# EAGLE design airflow_sensor_teensy2 (EAGLE 9.5.2)
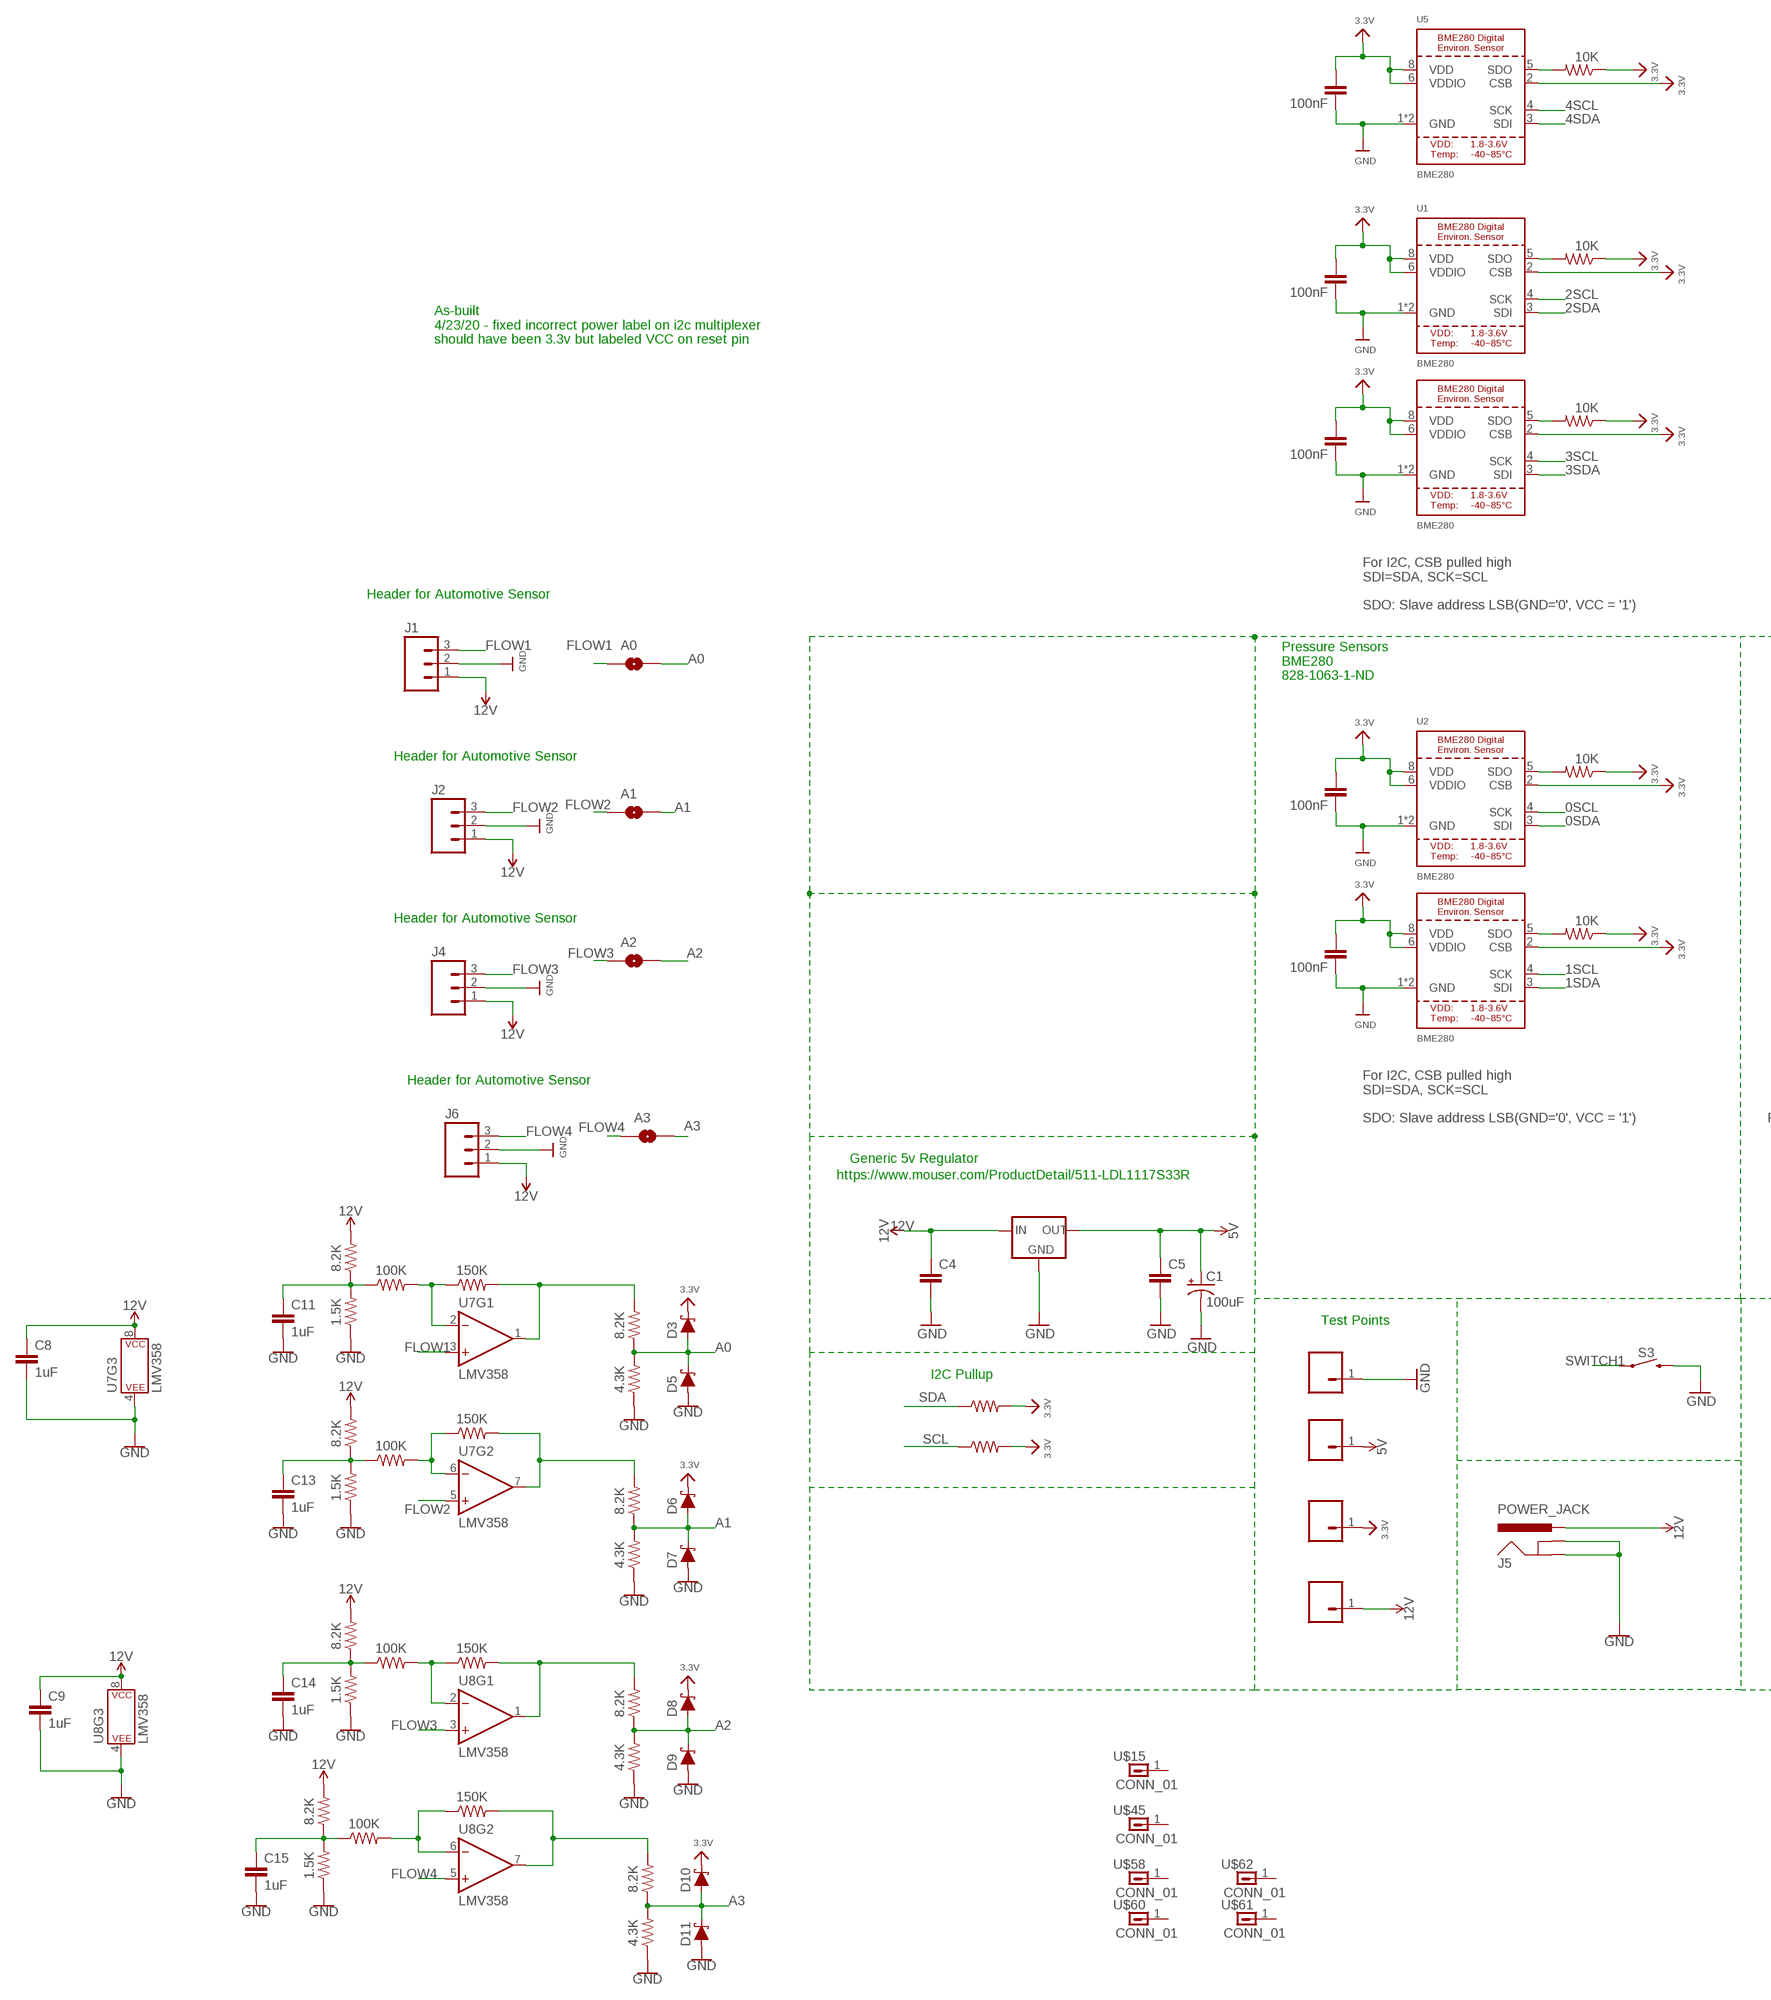
[diagram p0: schematic, sheet 1, part 1 of 2]
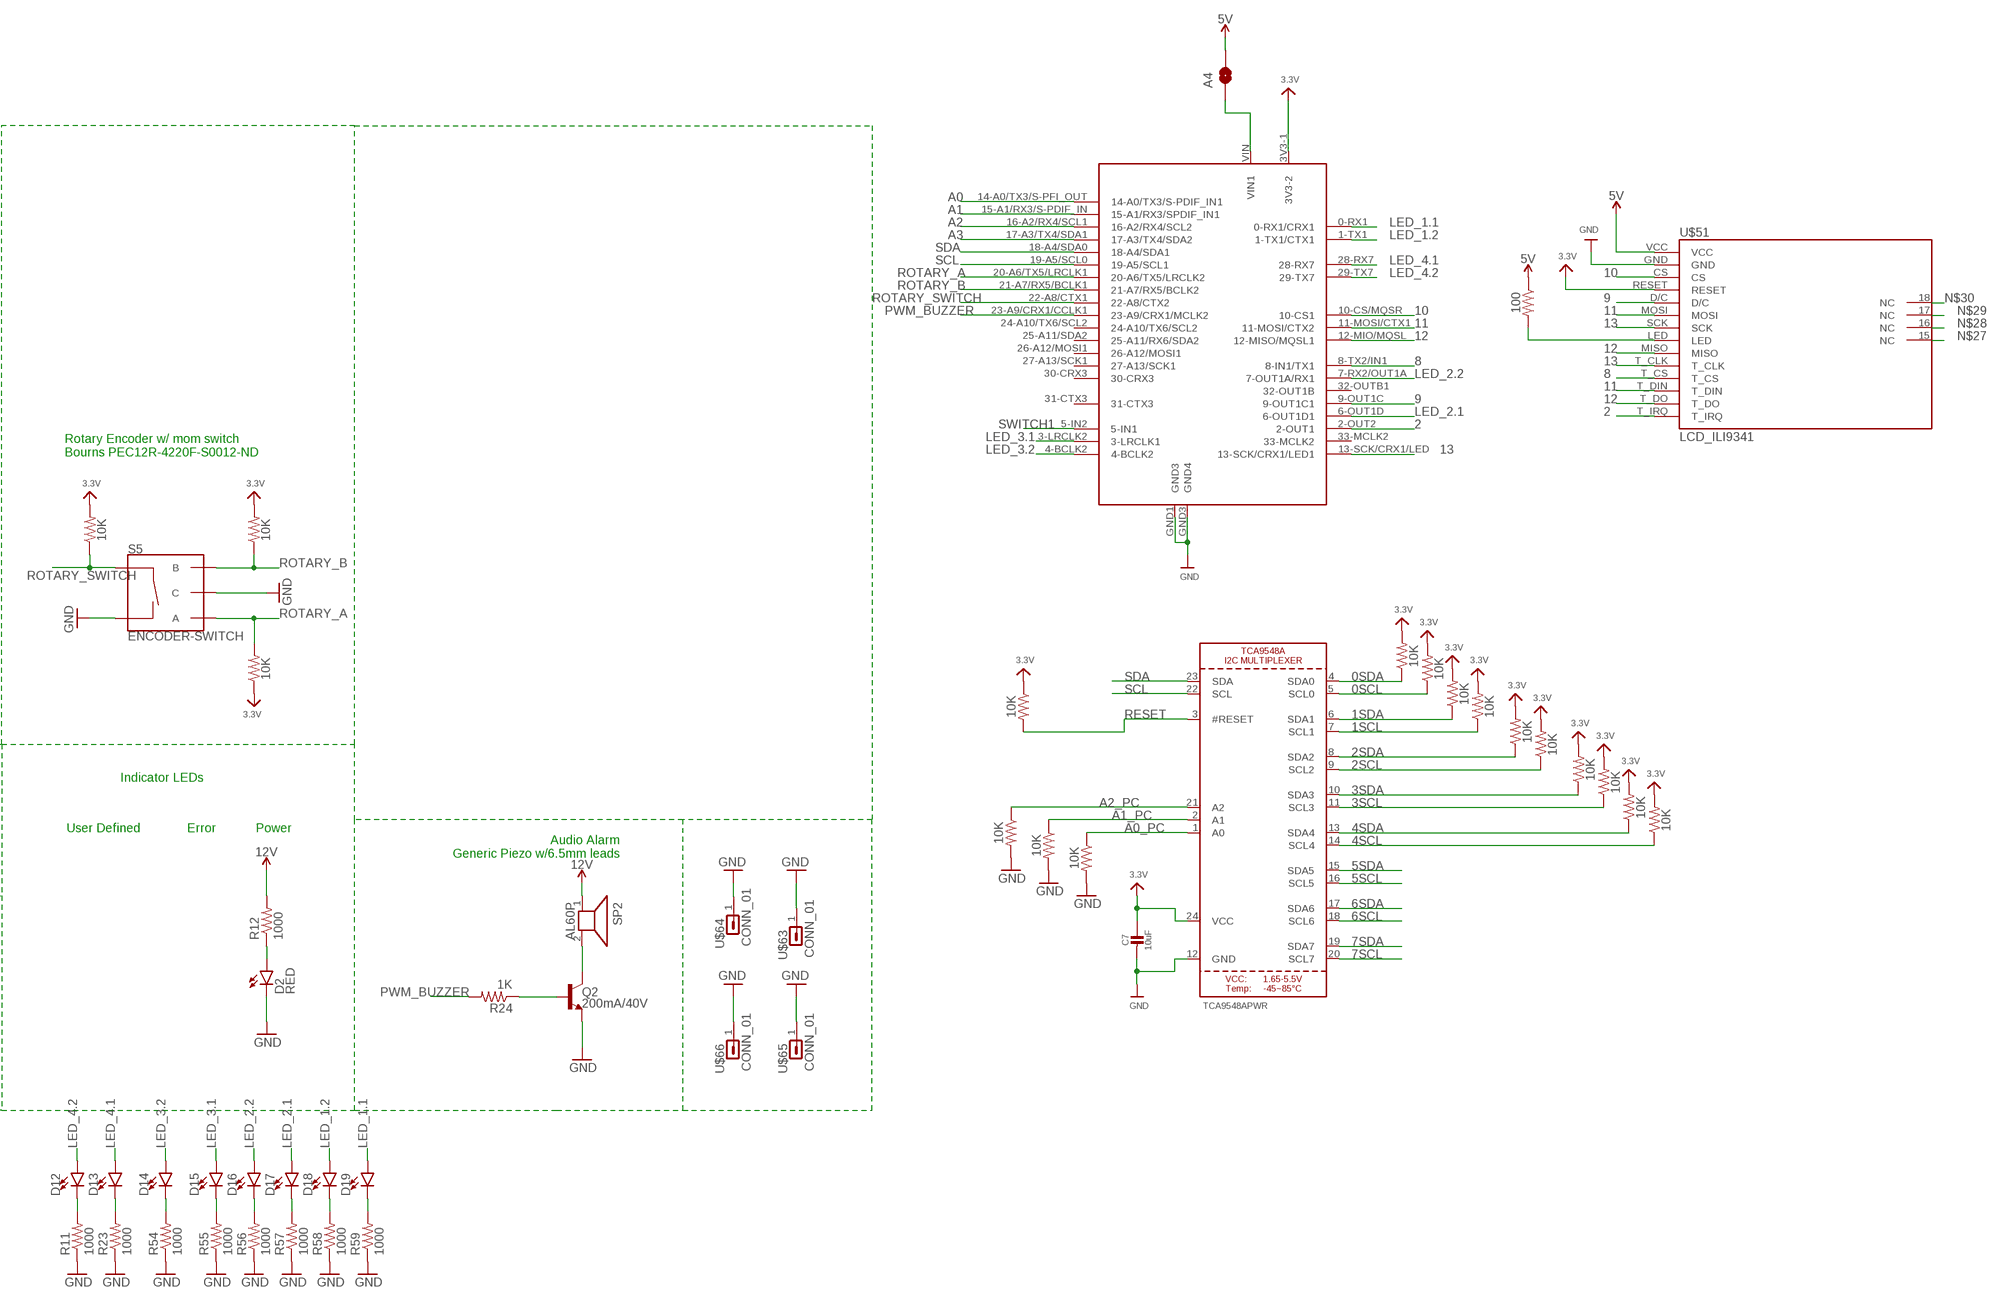
[diagram p1: schematic, sheet 1, part 2 of 2]

## Parts
3V_REGULATOR  LDL1117_5V_REG  [SOT223]
A0  JUMPER-SMT_2_NO_NO-SILK  [SMT-JUMPER_2_NO_NO-SILK]
A1  JUMPER-SMT_2_NO_NO-SILK  [SMT-JUMPER_2_NO_NO-SILK]
A2  JUMPER-SMT_2_NO_NO-SILK  [SMT-JUMPER_2_NO_NO-SILK]
A3  JUMPER-SMT_2_NO_NO-SILK  [SMT-JUMPER_2_NO_NO-SILK]
A4  JUMPER-SMT_2_NO_NO-SILK  [SMT-JUMPER_2_NO_NO-SILK]
C1  100uF  100UF-POLAR-RADIAL-2.5MM-25V-20%  [CPOL-RADIAL-2.5MM-6.5MM]
C2  100nF  CAP-0805  [0805]
C3  100nF  CAP-0805  [0805]
C4  CAP-0805  [0805]
C5  CAP-0805  [0805]
C6  100nF  CAP-0805  [0805]
C7  10uF  CAP_CERAMIC0805-NOOUTLINE  [0805-NO]
C8  1uF  CAP-0805  [0805]
C9  1uF  CAP-0805  [0805]
C10  100nF  CAP-0805  [0805]
C11  1uF  CAP-0805  [0805]
C12  100nF  CAP-0805  [0805]
C13  1uF  CAP-0805  [0805]
C14  1uF  CAP-0805  [0805]
C15  1uF  CAP-0805  [0805]
D2  RED  LED-RED1206  [LED-1206]
D3  3A/40V/500mV  DIODE-SCHOTTKY-B340A  [SMA-DIODE]
D5  3A/40V/500mV  DIODE-SCHOTTKY-B340A  [SMA-DIODE]
D6  3A/40V/500mV  DIODE-SCHOTTKY-B340A  [SMA-DIODE]
D7  3A/40V/500mV  DIODE-SCHOTTKY-B340A  [SMA-DIODE]
D8  3A/40V/500mV  DIODE-SCHOTTKY-B340A  [SMA-DIODE]
D9  3A/40V/500mV  DIODE-SCHOTTKY-B340A  [SMA-DIODE]
D10  3A/40V/500mV  DIODE-SCHOTTKY-B340A  [SMA-DIODE]
D11  3A/40V/500mV  DIODE-SCHOTTKY-B340A  [SMA-DIODE]
D12  LED5MM  [LED_5MM]
D13  LED5MM  [LED_5MM]
D14  LED5MM  [LED_5MM]
D15  LED5MM  [LED_5MM]
D16  LED5MM  [LED_5MM]
D17  LED5MM  [LED_5MM]
D18  LED5MM  [LED_5MM]
D19  LED5MM  [LED_5MM]
J1  M03SCREW  [SCREWTERMINAL-3.5MM-3]
J2  M03SCREW  [SCREWTERMINAL-3.5MM-3]
J4  M03SCREW  [SCREWTERMINAL-3.5MM-3]
J5  POWER_JACK  [POWER_JACK_PTH]
J6  M03SCREW  [SCREWTERMINAL-3.5MM-3]
Q2  200mA/40V  TRANS_NPN-2N3904  [TO-92]
R1  10K  RESISTOR0805-RES  [0805]
R2  10K  RESISTOR0805-RES  [0805]
R3  10K  RESISTOR0805-RES  [0805]
R4  10K  RESISTOR0805-RES  [0805]
R5  10K  RESISTOR0805-RES  [0805]
R6  10K  0.3OHM-0805-1/8W-1%  [0805]
R7  10K  0.3OHM-0805-1/8W-1%  [0805]
R8  10K  0.3OHM-0805-1/8W-1%  [0805]
R9  10K  0.3OHM-0805-1/8W-1%  [0805]
R10  10K  0.3OHM-0805-1/8W-1%  [0805]
R11  1000  RESISTOR0805-RES  [0805]
R12  1000  RESISTOR0805-RES  [0805]
R13  10K  0.3OHM-0805-1/8W-1%  [0805]
R14  10K  0.3OHM-0805-1/8W-1%  [0805]
R15  10K  0.3OHM-0805-1/8W-1%  [0805]
R16  10K  0.3OHM-0805-1/8W-1%  [0805]
R17  10K  0.3OHM-0805-1/8W-1%  [0805]
R18  10K  0.3OHM-0805-1/8W-1%  [0805]
R19  10K  0.3OHM-0805-1/8W-1%  [0805]
R20  10K  0.3OHM-0805-1/8W-1%  [0805]
R21  0.3  0.3OHM-0805-1/8W-1%  [0805]
R22  0.3  0.3OHM-0805-1/8W-1%  [0805]
R23  1000  RESISTOR0805-RES  [0805]
R24  1K  RESISTOR0805-RES  [0805]
R25  10K  0.3OHM-0805-1/8W-1%  [0805]
R26  10K  0.3OHM-0805-1/8W-1%  [0805]
R27  10K  0.3OHM-0805-1/8W-1%  [0805]
R28  10K  0.3OHM-0805-1/8W-1%  [0805]
R29  150K  0.3OHM-0805-1/8W-1%  [0805]
R30  150K  0.3OHM-0805-1/8W-1%  [0805]
R31  150K  0.3OHM-0805-1/8W-1%  [0805]
R32  150K  0.3OHM-0805-1/8W-1%  [0805]
R33  4.3K  0.3OHM-0805-1/8W-1%  [0805]
R34  8.2K  0.3OHM-0805-1/8W-1%  [0805]
R35  4.3K  0.3OHM-0805-1/8W-1%  [0805]
R36  8.2K  0.3OHM-0805-1/8W-1%  [0805]
R37  4.3K  0.3OHM-0805-1/8W-1%  [0805]
R38  8.2K  0.3OHM-0805-1/8W-1%  [0805]
R39  4.3K  0.3OHM-0805-1/8W-1%  [0805]
R40  8.2K  0.3OHM-0805-1/8W-1%  [0805]
R41  8.2K  0.3OHM-0805-1/8W-1%  [0805]
R42  1.5K  0.3OHM-0805-1/8W-1%  [0805]
R43  100K  0.3OHM-0805-1/8W-1%  [0805]
R44  8.2K  0.3OHM-0805-1/8W-1%  [0805]
R45  1.5K  0.3OHM-0805-1/8W-1%  [0805]
R46  100K  0.3OHM-0805-1/8W-1%  [0805]
R47  8.2K  0.3OHM-0805-1/8W-1%  [0805]
R48  1.5K  0.3OHM-0805-1/8W-1%  [0805]
R49  100K  0.3OHM-0805-1/8W-1%  [0805]
R50  8.2K  0.3OHM-0805-1/8W-1%  [0805]
R51  1.5K  0.3OHM-0805-1/8W-1%  [0805]
R52  100K  0.3OHM-0805-1/8W-1%  [0805]
R53  100  0.3OHM-0805-1/8W-1%  [0805]
R54  1000  RESISTOR0805-RES  [0805]
R55  1000  RESISTOR0805-RES  [0805]
R56  1000  RESISTOR0805-RES  [0805]
R57  1000  RESISTOR0805-RES  [0805]
R58  1000  RESISTOR0805-RES  [0805]
R59  1000  RESISTOR0805-RES  [0805]
S3  MOMENTARY-SWITCH-SPST-PTH-6.0MM-KIT  [TACTILE_SWITCH_PTH_6.0MM_KIT]
S5  ENCODER-SWITCH  [ROTARY_ENC_PLAIN]
SP2  AL60P  [AL60P]
U1  BME280  [BME280]
U2  BME280  [BME280]
U3  BME280  [BME280]
U4  BME280  [BME280]
U5  BME280  [BME280]
U6  TCA9548APWR  TCA9548A  [TSSOP24]
U7  LMV358  LMV358SOIC  [SO08]
U8  LMV358  LMV358SOIC  [SO08]
U$15  CONN_01  [1X01-#6_MACHINE]
U$20  CONN_0138MILL  [1X01-40MILL]
U$31  CONN_0138MILL  [1X01-40MILL]
U$40  CONN_0138MILL  [1X01-40MILL]
U$45  CONN_01  [1X01-#6_MACHINE]
U$51  LCD_ILI9341  [ILI9341]
U$58  CONN_01  [1X01-#6_MACHINE]
U$59  CONN_0138MILL  [1X01-40MILL]
U$60  CONN_01  [1X01-#6_MACHINE]
U$61  CONN_01  [1X01-#6_MACHINE]
U$62  CONN_01  [1X01-#6_MACHINE]
U$63  CONN_01  [1X01-#6_MACHINE]
U$64  CONN_01  [1X01-#6_MACHINE]
U$65  CONN_01  [1X01-#6_MACHINE]
U$66  CONN_01  [1X01-#6_MACHINE]
U$67  TEENSY_ALL_PINS  [TEENSY4-ALL_PINS]

## Nets
0SCL: R8.1 U2.4(SCK) U6.5(SCL0)
0SDA: R7.1 U2.3(SDI) U6.4(SDA0)
1SCL: R10.1 U4.4(SCK) U6.7(SCL1)
1SDA: R9.1 U4.3(SDI) U6.6(SDA1)
2: U$51.T_IRQ U$67.2-OUT2(2-OUT1)
2SCL: R14.1 U1.4(SCK) U6.9(SCL2)
2SDA: R13.1 U1.3(SDI) U6.8(SDA2)
3.3V: C2.1 C3.1 C6.1 C7.1 C10.1 C12.1 D3.C D6.C D8.C D10.C R1.1 R2.1 R3.1 R4.1 R5.1 R6.1 R7.2 R8.2 R9.2 R10.2 R13.2 R14.2 R15.2 R16.2 R17.2 R18.2 R21.2 R22.2 R26.2 R27.1 R28.2 U1.2(CSB) U1.6(VDDIO) U1.8(VDD) U2.2(CSB) U2.6(VDDIO) U2.8(VDD) U3.2(CSB) U3.6(VDDIO) U3.8(VDD) U4.2(CSB) U4.6(VDDIO) U4.8(VDD) U5.2(CSB) U5.6(VDDIO) U5.8(VDD) U6.24(VCC) U$20.1 U$51.RESET U$67.3V3-1(3V3-2)
3SCL: R16.1 U3.4(SCK) U6.11(SCL3)
3SDA: R15.1 U3.3(SDI) U6.10(SDA3)
4SCL: R18.1 U5.4(SCK) U6.14(SCL4)
4SDA: R17.1 U5.3(SDI) U6.13(SDA4)
5SCL: U6.16(SCL5)
5SDA: U6.15(SDA5)
5V: 3V_REGULATOR.2(OUT) 3V_REGULATOR.4(OUT) A4.2 C1.1(+) C5.1 R53.1 U$51.VCC U$59.1
6SCL: U6.18(SCL6)
6SDA: U6.17(SDA6)
7SCL: U6.20(SCL7)
7SDA: U6.19(SDA7)
8: U$51.T_CS U$67.8-TX2/IN1(8-IN1/TX1)
9: U$51.D/C U$67.9-OUT1C(9-OUT1C1)
10: U$51.CS U$67.10-CS/MQSR(10-CS1)
11: U$51.MOSI U$51.T_DIN U$67.11-MOSI/CTX1(11-MOSI/CTX2)
12: U$51.MISO U$51.T_DO U$67.12-MIO/MQSL(12-MISO/MQSL1)
12V: 3V_REGULATOR.3(IN) C4.1 C8.1 C9.1 J1.1 J2.1 J4.1 J5.PWR J6.1 R12.2 R41.2 R44.2 R47.2 R50.2 SP2.1 U7.8(P$V+) U8.8(P$V+) U$40.1
13: U$51.SCK U$51.T_CLK U$67.13-SCK/CRX1/LED(13-SCK/CRX1/LED1)
A0: A0.2 D3.A D5.C R33.2 R40.1 U$67.14-A0/TX3/S-PFI_OUT(14-A0/TX3/S-PDIF_IN1)
A0_PC: R19.1 U6.1(A0)
A1: A1.2 D6.A D7.C R34.1 R35.2 U$67.15-A1/RX3/S-PDIF_IN(15-A1/RX3/SPDIF_IN1)
A1_PC: R20.1 U6.2(A1)
A2: A2.2 D8.A D9.C R36.1 R37.2 U$67.16-A2/RX4/SCL1(16-A2/RX4/SCL2)
A2_PC: R25.1 U6.21(A2)
A3: A3.2 D10.A D11.C R38.1 R39.2 U$67.17-A3/TX4/SDA1(17-A3/TX4/SDA2)
FLOW1: A0.1 J1.3 U7.3(+IN)
FLOW2: A1.1 J2.3 U7.5(+IN)
FLOW3: A2.1 J4.3 U8.3(+IN)
FLOW4: A3.1 J6.3 U8.5(+IN)
GND: 3V_REGULATOR.1(GND) C1.2(-) C2.2 C3.2 C4.2 C5.2 C6.2 C7.2 C8.2 C9.2 C10.2 C11.2 C12.2 C13.2 C14.2 C15.2 D2.C D5.A D7.A D9.A D11.A J1.2 J2.2 J4.2 J5.GND J5.GNDBREAK J6.2 Q2.1(E) R11.1 R19.2 R20.2 R23.1 R25.2 R33.1 R35.1 R37.1 R39.1 R42.1 R45.1 R48.1 R51.1 R54.1 R55.1 R56.1 R57.1 R58.1 R59.1 S3.3 S5.C S5.SW- U1.1(GND) U1.7(GND) U2.1(GND) U2.7(GND) U3.1(GND) U3.7(GND) U4.1(GND) U4.7(GND) U5.1(GND) U5.7(GND) U6.12(GND) U7.4(P$V-) U8.4(P$V-) U$31.1 U$51.GND U$63.1 U$64.1 U$65.1 U$66.1 U$67.GND1(GND3) U$67.GND3(GND4)
LED_1.1: D19.A U$67.0-RX1(0-RX1/CRX1)
LED_1.2: D18.A U$67.1-TX1(1-TX1/CTX1)
LED_2.1: D17.A U$67.6-OUT1D(6-OUT1D1)
LED_2.2: D16.A U$67.7-RX2/OUT1A(7-OUT1A/RX1)
LED_3.1: D15.A U$67.3-LRCLK2(3-LRCLK1)
LED_3.2: D14.A U$67.4-BCLK2
LED_4.1: D13.A U$67.28-RX7
LED_4.2: D12.A U$67.29-TX7
N$1: R3.2 U1.5(SDO)
N$2: D2.A R12.1
N$3: D12.K(C) R11.2
N$5: R4.2 U3.5(SDO)
N$6: R1.2 U4.5(SDO)
N$7: D13.K(C) R23.2
N$8: R2.2 U2.5(SDO)
N$9: Q2.3(C) SP2.2
N$10: Q2.2(B) R24.1
N$11: D14.K(C) R54.2
N$12: R5.2 U5.5(SDO)
N$13: D15.K(C) R55.2
N$14: D16.K(C) R56.2
N$15: D17.K(C) R57.2
N$16: D18.K(C) R58.2
N$17: D19.K(C) R59.2
N$18: R32.2 R38.2 U8.7(OUT)
N$19: R32.1 R52.2 U8.6(-IN)
N$20: R31.2 R36.2 U8.1(OUT)
N$21: R31.1 R49.2 U8.2(-IN)
N$22: R30.2 R34.2 U7.7(OUT)
N$23: R30.1 R46.2 U7.6(-IN)
N$24: R29.2 R40.2 U7.1(OUT)
N$25: R29.1 R43.2 U7.2(-IN)
N$26: A4.1 U$67.VIN(VIN1)
N$27: U$51.15(NC)
N$28: U$51.16(NC)
N$29: U$51.17(NC)
N$30: U$51.18(NC)
N$35: R53.2 U$51.LED
PWM_BUZZER: R24.2 U$67.23-A9/CRX1/CCLK1(23-A9/CRX1/MCLK2)
RESET: R6.2 U6.3(#RESET)
ROTARY_A: R27.2 S5.A U$67.20-A6/TX5/LRCLK1(20-A6/TX5/LRCLK2)
ROTARY_B: R26.1 S5.B U$67.21-A7/RX5/BCLK1(21-A7/RX5/BCLK2)
ROTARY_SWITCH: R28.1 S5.SW+ U$67.22-A8/CTX1(22-A8/CTX2)
SCL: R22.1 U6.22(SCL) U$67.19-A5/SCL0(19-A5/SCL1)
SDA: R21.1 U6.23(SDA) U$67.18-A4/SDA0(18-A4/SDA1)
SWITCH1: S3.1 U$67.5-IN2(5-IN1)
X4: C14.1 R47.1 R48.2 R49.1
X5: C15.1 R50.1 R51.2 R52.1
XX: C13.1 R44.1 R45.2 R46.1
XXX: C11.1 R41.1 R42.2 R43.1
Unconnected: U$15.1 U$45.1 U$58.1 U$60.1 U$61.1 U$62.1 U$67.24-A10/TX6/SCL2 U$67.25-A11/SDA2(25-A11/RX6/SDA2) U$67.26-A12/MOSI1 U$67.27-A13/SCK1 U$67.30-CRX3 U$67.31-CTX3 U$67.32-OUTB1(32-OUT1B) U$67.33-MCLK2

## Notes on the sheet
- As-built
  4/23/20 - fixed incorrect power label on i2c multiplexer
  should have been 3.3v but labeled VCC on reset pin
- Header for Automotive Sensor
- For I2C, CSB pulled high
  SDI=SDA, SCK=SCL
  
  SDO: Slave address LSB(GND='0', VCC = '1')
- Pressure Sensors
  BME280
  828-1063-1-ND
- Header for Automotive Sensor
- Header for Automotive Sensor
- Rotary Encoder w/ mom switch
  Bourns PEC12R-4220F-S0012-ND
- Header for Automotive Sensor
- For I2C, CSB pulled high
  SDI=SDA, SCK=SCL
  
  SDO: Slave address LSB(GND='0', VCC = '1')
- Generic 5v Regulator
- https://www.mouser.com/ProductDetail/511-LDL1117S33R
- Test Points
- Indicator LEDs
- I2C Pullup
- User Defined | Error | Power
- Audio Alarm
  Generic Piezo w/6.5mm leads

## Library data of the parts
3V_REGULATOR = th_libraries_2:LDL1117_5V_REG: STMicroelectronics LDL1117S50R https://www.mouser.com/datasheet/2/389/ldl1117-1156241.pdf Mouser#: 511-LDL1117S50R bought 100 for $18 on ~2/3/18 5V, 1.2amp
A0 A1-A4 = SparkFun-Jumpers:JUMPER-SMT_2_NO: Normally open jumper This jumper has two pads in close proximity to each other. Apply solder to close the connection. Round pads are easier to solder for beginners, but are a lot larger. SparkFun Product that uses the round pads: SparkFun EL Sequencer <https://www.sparkfun.com/products/12781>
C1 = SparkFun-Capacitors:100UF-POLAR: 100µF polarized capacitors A capacitor is a passive two-terminal electrical component used to store electrical energy temporarily in an electric field.; PROD_ID: CAP-08439
C2-C6 C8-C15 = SparkFun-Capacitors:CAP
C7 = microbuilder:CAP_CERAMIC: Ceramic Capacitors For new designs, use the packages preceded by an '_' character since they are more reliable: The following footprints should be used on most boards: _0402 - Standard footprint for regular board layouts _0603 - Standard footprint for regular board layouts _0805 - Standard footprint for regular board layouts _1206 - Standard footprint for regular board layouts For extremely tight-pitch boards where space is at a premium, the following 'micro-pitch' footprints can be used (smaller pads, no silkscreen outline, etc.): _0402MP - Micro-pitch footprint for very dense/compact boards _0603MP - Micro-pitch footprint for very dense/compact boards _0805MP - Micro-pitch footprint for very dense/compact boards _1206MP - Micro-pitch footprint for very dense/compact boards
D2 = SparkFun-LED:LED-RED: Red SMD LED Used in manufacturing of most products at SparkFun Packages: 0603 - SMD 0603 package [Product Link] <http://docs.avagotech.com/docs/AV02-0551EN> 0603 SMART - SMD 0603 SMART package ( more efficient and expensive)[Product Link] <http://www.osram-os.com/Graphics/XPic2/00077099_0.pdf> 1206 - SMD1206 package [Product Link] <https://www.sparkfun.com/datasheets/DevTools/LilyPad/Q150OVS4.pdff> SparkFun Products: Pro Mini 328 -5V <https://www.sparkfun.com/products/821> RedBoard <https://www.sparkfun.com/products/12757> IOIO-OTG <https://www.sparkfun.com/products/13613>; PROD_ID: DIO-09912
D3 D5-D11 = SparkFun-DiscreteSemi:DIODE-SCHOTTKY: Schottky diode A Schottky diode is a semiconductor diode which has a low forward voltage drop and a very fast switching action.; PROD_ID: DIO-09886
D12-D19 = SparkFun-LED:LED: LED (Generic) Standard schematic elements and footprints for 5mm, 3mm, 1206, and 0603 sized LEDs. Generic LEDs with no color specified.
J1 J2 J4 J6 = SparkFun-Connectors:M03: Header 3 Standard 3-pin 0.1" header. Use with straight break away headers (SKU : PRT-00116), right angle break away headers (PRT-00553), swiss pins (PRT-00743), machine pins (PRT-00117), and female headers (PRT-00115). Molex polarized connector foot print use with SKU : PRT-08232 with associated crimp pins and housings.; PROD_ID: CONN-08288
J5 = SparkFun-Connectors:POWER_JACK: Power Jack Connector This is the standard 5.5mm barrel jack for power. The PTH is the most common, proven, reliable, footprint. The Slot footprint only works if the mill layer is transmitted to the PCB fab house so be warned. Here are the connectors we sell at SparkFun: DC Barrel Power Jack/Connector <https://www.sparkfun.com/products/119> (PRT-00119) DC Barrel Power Jack/Connector (SMD) <https://www.sparkfun.com/products/12748> (PRT-12748) DC Barrel Jack Adapter - Breadboard Compatible <https://www.sparkfun.com/products/10811> (PRT-10811) It is used on this SparkFun product (and many, many others): SparkFun RedBoard - Programmed with Arduino <https://www.sparkfun.com/products/12757> (DEV-12757) Also, if you need a mating power supply or connector, please check these out: Wall Adapter Power Supply - 9VDC 650mA <https://www.sparkfun.com/products/298> (TOL-00298) DC Barrel Jack Adapter - Male <https://www.sparkfun.com/products/10287> (PRT-10287); PROD_ID: CONN-08197
Q2 = SparkFun-DiscreteSemi:TRANS_NPN: NPN transistor Current controlled devices typically used to amplify current or used as a switch. BC547 - COM-08928 <http://www.sparkfun.com/products/8928> (TO-92 45V 100mA) (1.Collector 2.Base 3.Emitter) 2N3904 - COM-00521 <http://www.sparkfun.com/products/521> (TO-92 40V 200mA) (1.Emitter 2.Base 3.Collector) P2N2222A - COM-12852 <http://www.sparkfun.com/products/12852> (TO-92 40V 600mA) (1.Collector 2.Base 3.Emitter); PROD_ID: TRANS-08447
R1-R5 R11 R12 R23 R24 R54-R59 = SparkFun-Passives:RESISTOR: Resistor Basic schematic elements and footprints for 0603, 1206, and PTH resistors.
R6-R10 R13-R20 R25-R53 = SparkFun-Resistors:0.3OHM: 0.3Ω resistor A resistor is a passive two-terminal electrical component that implements electrical resistance as a circuit element. Resistors act to reduce current flow, and, at the same time, act to lower voltage levels within circuits. - Wikipedia; PROD_ID: RES-11622; VALUE: 0.3
R21 R22 = SparkFun-Resistors:0.3OHM: 0.3Ω resistor A resistor is a passive two-terminal electrical component that implements electrical resistance as a circuit element. Resistors act to reduce current flow, and, at the same time, act to lower voltage levels within circuits. - Wikipedia; PROD_ID: RES-11622
S3 = SparkFun-Switches:MOMENTARY-SWITCH-SPST: Momentary Switch (Pushbutton) - SPST Normally-open (NO) SPST momentary switches (buttons, pushbuttons). Variants PTH-12MM - 12mm square, through-hole Momentary Pushbutton Switch - 12mm Square <https://www.sparkfun.com/products/9190> (COM-09190) PTH-6.0MM, PTH-6.0MM-KIT - 6.0mm square, through-hole Mini Pushbutton Switch <https://www.sparkfun.com/products/97> (COM-00097) KIT package intended for soldering kit's - only one side of pads' copper is exposed. PTH-RIGHT-ANGLE-KIT - Right-angle, through-hole Right Angle Tactile Button <https://www.sparkfun.com/products/10791> - Used on SparkFun BigTime Watch Kit <https://www.sparkfun.com/products/11734> SMD-12MM - 12mm square, surface-mount Tactile Button - SMD (12mm) <https://www.sparkfun.com/products/12993> (COM-12993) Used on SparkFun PicoBoard <https://www.sparkfun.com/products/11888> SMD-4.5MM - 4.5mm Square Trackball Switch Used on SparkFun Blackberry Trackballer Breakout <https://www.sparkfun.com/products/13169> SMD-4.6MMX2.8MM - 4.60mm x 2.80mm, surface mount Used on SparkFun SAMD21 Mini Breakout <https://www.sparkfun.com/products/13664> SMD-5.2MM, SMD-5.2-REDUNDANT - 5.2mm square, surface-mount Mini Pushbutton Switch - SMD <https://www.sparkfun.com/products/8720> (COM-08720) Used on Arduino Pro Mini <https://www.sparkfun.com/products/11114> REDUNDANT package connects both switch circuits together SMD-6.0X3.5MM - 6.0 x 3.5mm, surface mount Momentary Reset Switch SMD <https://www.sparkfun.com/products/8229> (COM-08229) SMD-6.2MM-TALL - 6.2mm square, surface mount Tactile Button - SMD (6mm) <https://www.sparkfun.com/products/12992> Used on SparkFun Digital Sandbox <https://www.sparkfun.com/products/12651> SMD-RIGHT-ANGLE - Right-angle, surface mount Used on SparkFun Block for Intel® Edison - Arduino <https://www.sparkfun.com/products/13036>; PROD_ID: SWCH-08441; SF_SKU: COM-00097
S5 = SparkFun-Switches:ENCODER-SWITCH: Rotary Encoder w/ Select Switch Encoders rotate similarly to potentiometers, but they’re different from potentiometers in that an encoder has full rotation without limits. They output gray code so that you can tell how much and in which direction the encoder has been turned. This encoder includes a push-down select switch built into the shaft. SparkFun Products Rotary Encoder <https://www.sparkfun.com/products/9117> (COM-09117); SF_SKU: COM-09117
SP2 = buzzer:AL60P: SPEAKER Source: Buerklin; OC_FARNELL: unknown; OC_NEWARK: unknown
U1-U5 = microbuilder:BME280: BME280 - Environmental Sensor (I2C + SPI)
U6 = microbuilder:TCA9548A: TCA9548A I2C Multiplexer
U7 U8 = SparkFun-IC-Amplifiers:LMV358: IC LMV358 DUAL OP AMP Jellybean rail-to-rail output op-amp SparkFun Products SparkFun PicoBoard <https://www.sparkfun.com/products/11888> (WIG-11888) SparkFun Vernier Interface Shield <https://www.sparkfun.com/products/12858> (DEV-12858) SparkFun Blynk Board - ESP8266 <https://www.sparkfun.com/products/13794> (WRL-13794) SparkFun Digital Sandbox <https://www.sparkfun.com/products/12651> (DEV-12651 RoHS); PROD_ID: IC-09657
U$15 U$45 U$58 U$60-U$66 = th_libraries:CONN_01: #6 Machine Screw tite - 144mil hole, 256mil diameter
U$20 U$31 U$40 U$59 = th_libraries3:CONN_01: #6 Machine Screw tite - 144mil hole, 256mil diameter
U$51 = ili9341_Display:LCD_ILI9341: PJRC Touch Display https://www.pjrc.com/store/display_ili9341_touch.html
U$67 = teensy:TEENSY_ALL_PINS

## Net classes
1 highpower: width 0.305 mm, drill 0.483 mm
2 lowpower: width 0.305 mm, drill 0.483 mm

## Board
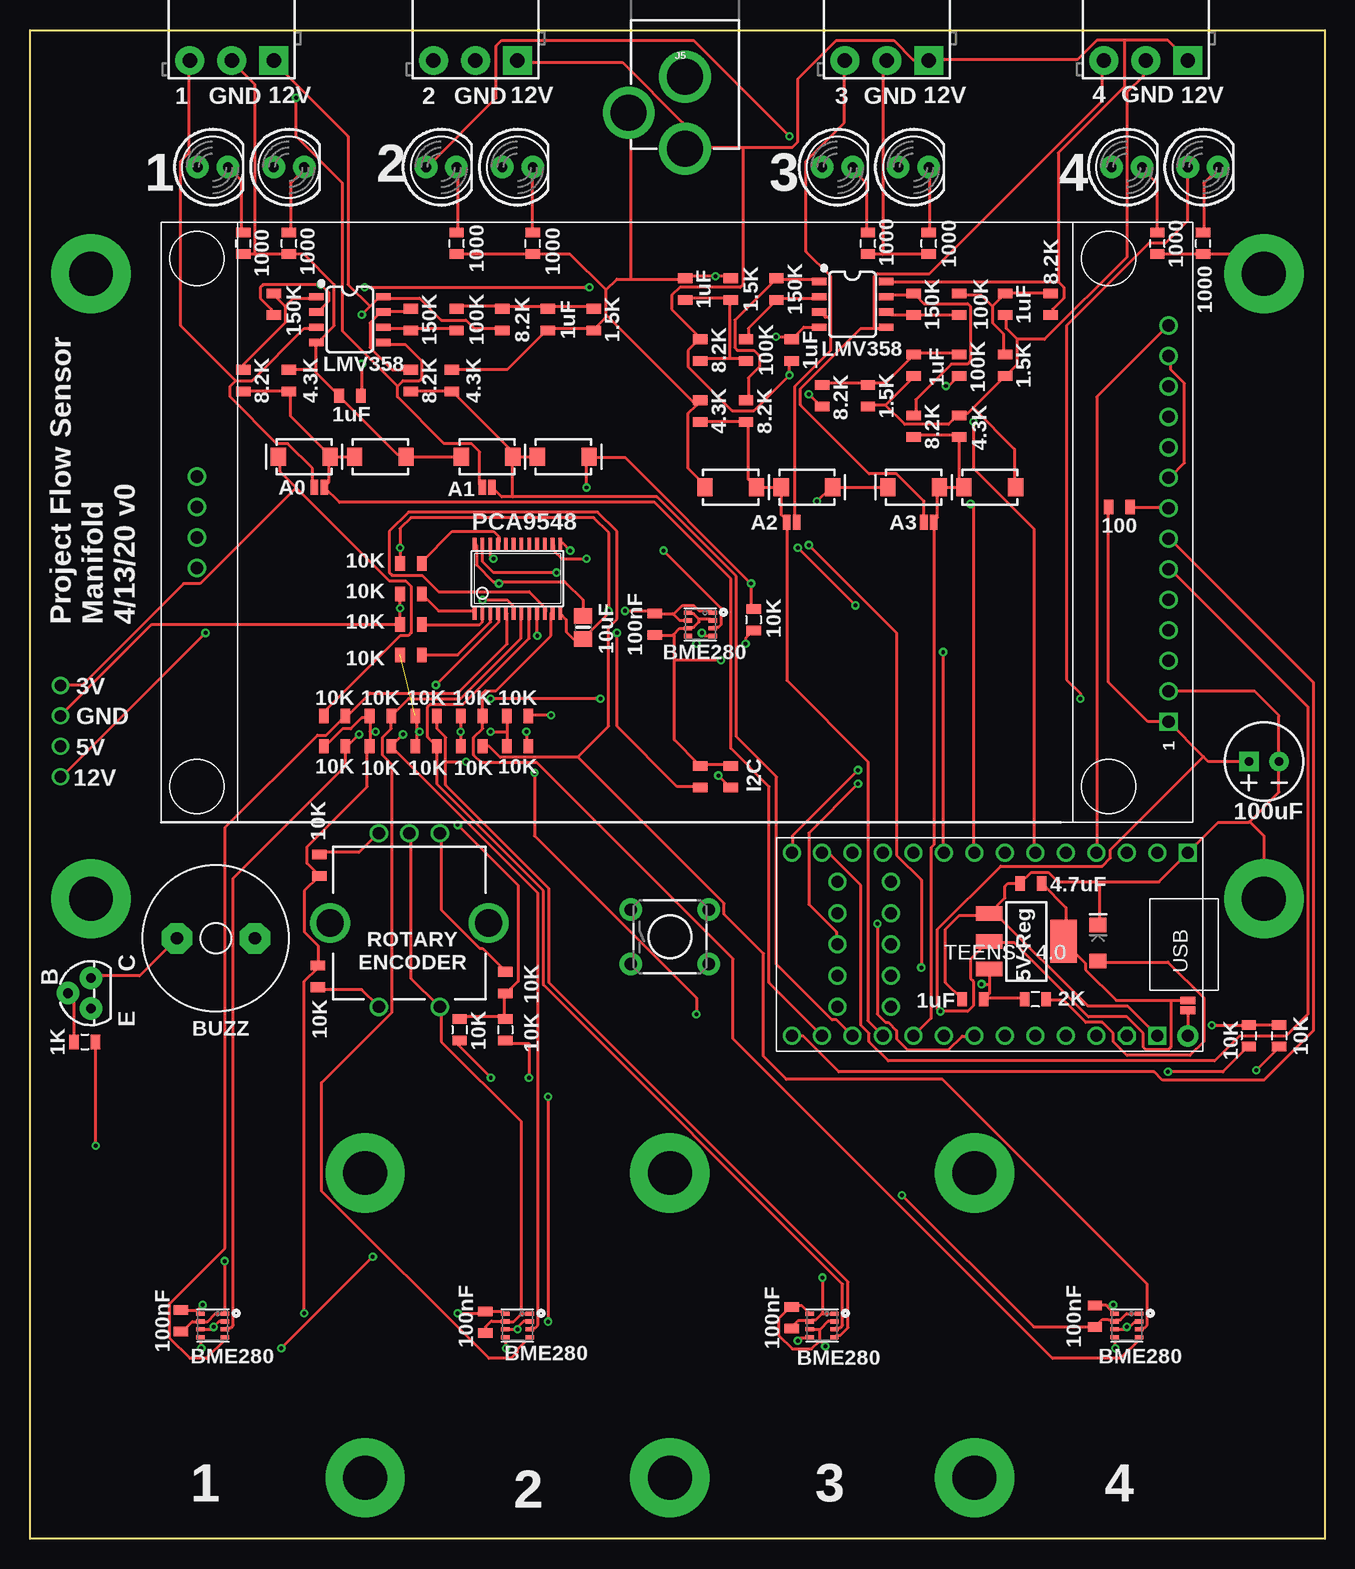
[diagram p2: board, top side]
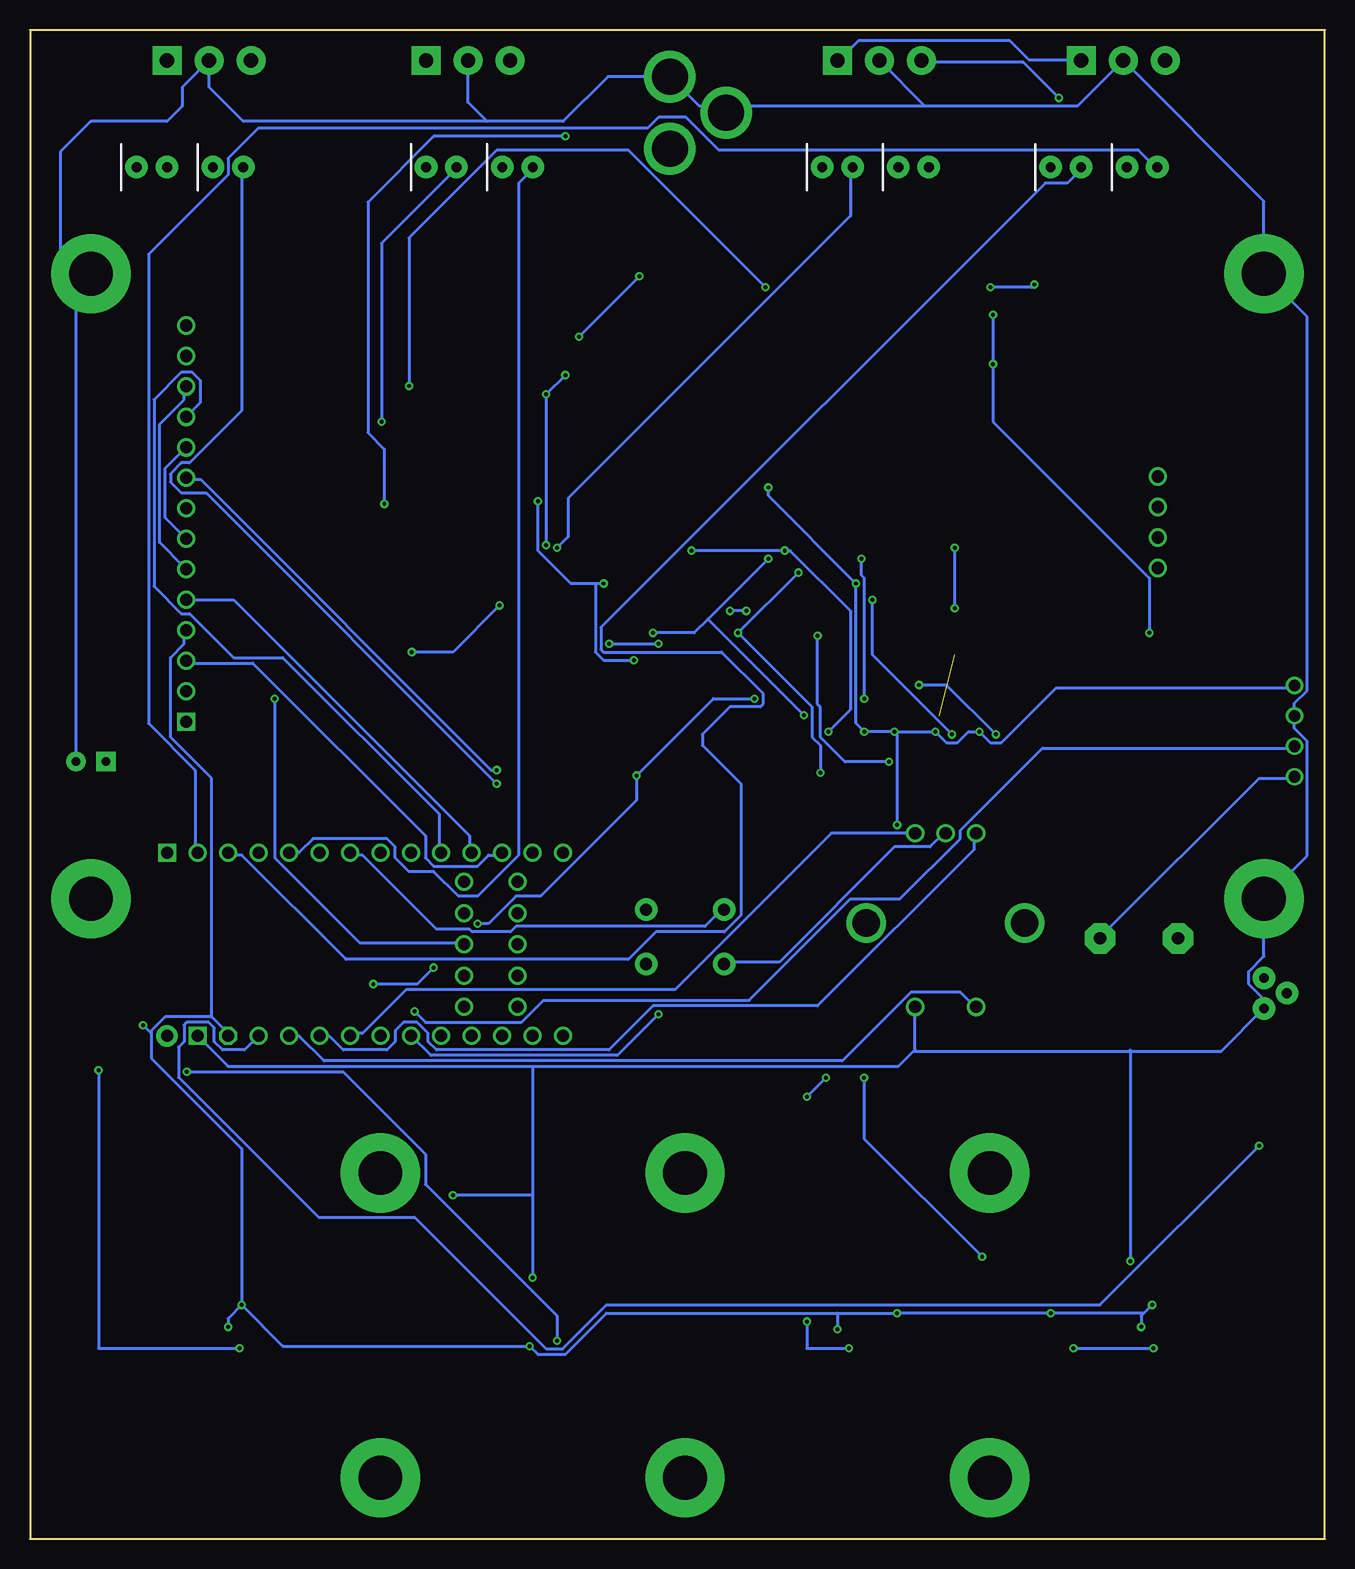
[diagram p3: board, bottom side, seen from below]

Size 107.95 x 125.73 mm. Coordinates in mm from the lower left corner, seen from the top.
Outline: 0,0 0,125.73 107.95,125.73 107.95,0 0,0
Copper layers (1*16): Top 0.0356mm / dielectric 1.5011mm / Bottom 0.0356mm
Design rules "LaenPCBOrder *": minimum track width 10mil, minimum drill 13mil, track to track 8mil, track to pad 8mil, pad to pad 8mil, via to via 8mil, smd to smd 6mil, copper to edge 15mil, drill to drill 6mil, minimum pad ring 7mil, minimum via ring 7mil, stop-mask expansion 3mil, vias tented up to drill 25mil, thermal gap 10mil

### Footprints (pad centres in the part's own frame; a part is rotated, then mirrored left to right if it is on the bottom)
SOT223 = smd 1.219 x 2.235: 1 -2.311,-3.099; 2 0,-3.099; 3 2.311,-3.099 | smd 3.6 x 2.2: 4 0,3.099
SMT-JUMPER_2_NO_NO-SILK = smd 0.635 x 1.27: 1 -0.406,0; 2 0.406,0
CPOL-RADIAL-2.5MM-6.5MM = drill 0.7 pad 1.651 square: 1 1.25,0 | drill 0.7 pad 1.651: 2 -1.25,0
0805 = smd 0.8 x 1.2: 1 -0.9,0; 2 0.9,0
0805-NO = smd 1.3 x 1.5: 1 -0.95,0; 2 0.95,0
LED-1206 = smd 1.2 x 1.4: A -1.5,0; C 1.5,0
SMA-DIODE = smd 1.27 x 1.47: A -2.15,0; C 2.15,0
LED_5MM = drill 0.813 pad 1.88: A -1.27,0; K 1.27,0
SCREWTERMINAL-3.5MM-3 = drill 1.2 pad 2.413 square: 1 0,0 | drill 1.2 pad 2.413: 2 3.5,0; 3 7,0
POWER_JACK_PTH = drill 2.997 pad 4.318: GND 0,7.7; GNDBREAK 4.7,10.7; PWR 0,13.7
TO-92 = drill 0.813 pad 1.88: 1 -1.27,0; 2 0,1.905; 3 1.27,0
TACTILE_SWITCH_PTH_6.0MM_KIT = drill 1.016 pad 1.88: 1 -3.251,2.261; 2 3.251,2.261; 3 -3.251,-2.261; 4 3.251,-2.261
ROTARY_ENC_PLAIN = drill 1.016: A 7.493,-2.54; B 7.493,2.54; C 7.493,0; SW+ -6.985,2.54; SW- -6.985,-2.54 | drill 2.286: P$3 0,6.604; P$4 0,-6.604
AL60P = drill 1.016 pad 2.54 octagon: 1 -3.251,0; 2 3.251,0
BME280 = smd 0.7 x 0.35: 1 1.025,0.975; 2 1.025,0.325; 3 1.025,-0.325; 4 1.025,-0.975; 5 -1.025,-0.975; 6 -1.025,-0.325; 7 -1.025,0.325; 8 -1.025,0.975
TSSOP24 = smd 0.305 x 0.991: 1 -3.575,-2.918; 2 -2.925,-2.918; 3 -2.275,-2.918; 4 -1.625,-2.918; 5 -0.975,-2.918; 6 -0.325,-2.918; 7 0.325,-2.918; 8 0.975,-2.918; 9 1.625,-2.918; 10 2.275,-2.918; 11 2.925,-2.918; 12 3.575,-2.918; 13 3.575,2.918; 14 2.925,2.918; 15 2.275,2.918; 16 1.625,2.918; 17 0.975,2.918; 18 0.325,2.918; 19 -0.325,2.918; 20 -0.975,2.918; 21 -1.625,2.918; 22 -2.275,2.918; 23 -2.925,2.918; 24 -3.575,2.918
SO08 = smd 0.6 x 1.2: 1 -1.905,-2.8; 2 -0.635,-2.8; 3 0.635,-2.8; 4 1.905,-2.8; 5 1.905,2.8; 6 0.635,2.8; 7 -0.635,2.8; 8 -1.905,2.8
1X01-#6_MACHINE = drill 3.658 pad 6.604: 1 0,0
1X01-40MILL = drill 0.965 pad 1.397: 1 0,0
ILI9341 = drill 1.016: 15 3,21.21; 16 3,23.75; 17 3,26.29; 18 3,28.83; CS 84,13.48; D/C 84,18.56; GND 84,10.94; LED 84,26.18; MISO 84,28.72; MOSI 84,21.1; RESET 84,16.02; SCK 84,23.64; T_CLK 84,31.26; T_CS 84,33.8; T_DIN 84,36.34; T_DO 84,38.88; T_IRQ 84,41.42 | drill 1.016 square: VCC 84,8.4
TEENSY4-ALL_PINS = drill 1: 0-RX1 -17.78,-7.62; 1-TX1 -15.24,-7.62; 2-OUT2 -12.7,-7.62; 3-LRCLK2 -10.16,-7.62; 4-BCLK2 -7.62,-7.62; 5-IN2 -5.08,-7.62; 6-OUT1D -2.54,-7.62; 7-RX2/OUT1A 0,-7.62; 8-TX2/IN1 2.54,-7.62; 9-OUT1C 5.08,-7.62; 10-CS/MQSR 7.62,-7.62; 11-MOSI/CTX1 10.16,-7.62; 12-MIO/MQSL 12.7,-7.62; 13-SCK/CRX1/LED 12.7,7.62; 14-A0/TX3/S-PFI_OUT 10.16,7.62; 15-A1/RX3/S-PDIF_IN 7.62,7.62; 16-A2/RX4/SCL1 5.08,7.62; 17-A3/TX4/SDA1 2.54,7.62; 18-A4/SDA0 0,7.62; 19-A5/SCL0 -2.54,7.62; 20-A6/TX5/LRCLK1 -5.08,7.62; 21-A7/RX5/BCLK1 -7.62,7.62; 22-A8/CTX1 -10.16,7.62; 23-A9/CRX1/CCLK1 -12.7,7.62; 24-A10/TX6/SCL2 8.89,5.207; 25-A11/SDA2 4.445,5.207; 26-A12/MOSI1 8.89,2.603; 27-A13/SCK1 4.445,2.603; 28-RX7 8.89,0; 29-TX7 4.445,0; 30-CRX3 8.89,-2.603; 31-CTX3 4.445,-2.603; 32-OUTB1 8.89,-5.207; 33-MCLK2 4.445,-5.207 | drill 1 octagon: 3V3-1 -15.24,7.62 | drill 1 square: GND1 -20.32,-7.62; GND3 -17.78,7.62 | drill 1 pad 1.778: VIN -20.32,7.62

### Placement (x,y rotation side)
3V_REGULATOR  83.06,49.78 270 top
A0  24.13,87.63 0 top
A1  38.1,87.63 0 top
A2  63.5,84.71 180 top
A3  74.93,84.71 0 top
A4  96.52,44.45 90 top
C1  102.87,64.77 180 top
C2  63.5,18.41 270 top
C3  88.77,18.54 270 top
C4  78.61,44.96 180 top
C5  83.44,54.61 180 top
C6  52.07,76.2 90 top
C7  46.1,75.95 270 top
C8  26.67,95.25 180 top
C9  63.5,99.06 90 top
C10  12.57,18.16 270 top
C11  73.66,97.79 270 top
C12  37.97,18.03 270 top
C13  43.18,101.6 270 top
C14  54.61,104.14 90 top
C15  81.28,102.87 270 top
D2  89.03,49.66 90 top
D3  22.86,90.17 180 top
D5  29.21,90.17 180 top
D6  44.45,90.17 0 top
D7  38.1,90.17 0 top
D8  64.77,87.63 0 top
D9  58.42,87.63 0 top
D10  73.66,87.63 180 top
D11  80.01,87.63 180 top
D12  97.79,114.3 0 top
D13  91.44,114.3 0 top
D14  73.66,114.3 0 top
D15  67.31,114.3 0 top
D16  40.64,114.3 0 top
D17  34.29,114.3 0 top
D18  21.59,114.3 0 top
D19  15.24,114.3 0 top
J1  20.32,123.19 180 top
J2  40.64,123.19 180 top
J4  74.93,123.19 180 top
J5  54.61,129.54 180 top
J6  96.52,123.19 180 top
Q2  5.08,45.47 90 top
R1  39.62,42.42 270 top
R2  35.81,42.42 270 top
R3  101.6,41.91 270 top
R4  104.14,41.91 270 top
R5  60.33,76.58 270 top
R6  31.75,73.66 0 top
R7  25.4,66.04 180 top
R8  25.4,68.58 180 top
R9  29.21,66.04 180 top
R10  29.21,68.58 180 top
R11  97.79,107.95 90 top
R12  83.82,44.96 180 top
R13  33.02,66.04 180 top
R14  33.02,68.58 180 top
R15  36.83,66.04 180 top
R16  36.83,68.58 180 top
R17  40.64,66.04 180 top
R18  40.64,68.58 180 top
R19  31.75,78.74 180 top
R20  31.75,76.2 180 top
R21  55.88,63.5 90 top
R22  58.42,63.5 90 top
R23  93.98,107.95 90 top
R24  4.57,41.4 0 top
R25  31.75,81.28 180 top
R26  24.13,56.13 270 top
R27  39.62,46.36 90 top
R28  24,46.86 90 top
R29  20.32,102.87 90 top
R30  31.75,101.6 90 top
R31  62.23,104.14 90 top
R32  73.66,102.87 90 top
R33  21.59,96.52 270 top
R34  31.75,96.52 90 top
R35  35.18,96.52 270 top
R36  59.69,93.98 90 top
R37  55.88,93.98 270 top
R38  73.66,92.71 90 top
R39  77.47,92.71 270 top
R40  17.78,96.52 90 top
R41  66.04,95.25 270 top
R42  69.85,95.25 90 top
R43  77.47,97.79 270 top
R44  39.37,101.6 270 top
R45  46.99,101.6 90 top
R46  35.56,101.6 270 top
R47  55.88,99.06 90 top
R48  58.42,104.14 270 top
R49  59.69,99.06 90 top
R50  85.09,102.87 270 top
R51  81.28,97.79 90 top
R52  77.47,102.87 270 top
R53  90.81,85.98 0 top
R54  74.93,107.95 90 top
R55  69.85,107.95 90 top
R56  41.91,107.95 90 top
R57  35.56,107.95 90 top
R58  21.59,107.95 90 top
R59  17.78,107.95 90 top
S3  53.34,50.17 0 top
S5  31.62,51.31 90 top
SP2  15.49,50.04 180 top
U1  66.04,17.78 0 top
U2  15.24,17.78 0 top
U3  91.44,17.78 0 top
U4  40.64,17.78 0 top
U5  55.88,76.2 0 top
U6  40.64,80.01 0 top
U7  26.67,101.6 270 top
U8  68.58,102.87 270 top
U$15  27.94,30.48 0 top
U$20  2.54,71.12 270 top
U$31  2.54,68.58 270 top
U$40  2.54,63.5 270 top
U$45  27.94,5.08 0 top
U$51  10.92,59.69 0 top
U$58  78.74,30.48 0 top
U$59  2.54,66.04 0 top
U$60  78.74,5.08 0 top
U$61  53.34,30.48 0 top
U$62  53.34,5.08 0 top
U$63  5.08,53.34 0 top
U$64  102.87,53.34 0 top
U$65  5.08,105.41 0 top
U$66  102.87,105.41 0 top
U$67  76.2,49.53 180 top

### Tracks (layer width: path | path; a pad name or v marks a point on that pad's centre or on a via)
0SCL
  Top 0.254: U2.4 16.27,16.59 14.7,15.03 13.34,15.03 11.64,16.72 11.64,19.6 16.27,24.22 16.27,59.27 23.96,66.97 24.69,66.97 R8.1 26.52,68.63 28.35,70.46 35.66,70.46 39.78,74.57 39.78,77.09 U6.5
0SDA  (via drill 0.33)
  Top 0.254: U2.3 16.41,17.6 16.75,17.6 16.95,17.79 16.95,55.05 26.3,64.4 R7.1 26.52,66.12 v27.43,67.03 | v33.83,71.14 39.09,76.4 39.09,77.09 U6.4
  Bottom 0.254: v33.83,71.14 31.55,71.14 v27.43,67.03
1SCL
  Top 0.254: U4.4 40.61,15.75 40.61,15.54 40.1,15.03 38.25,15.03 24.31,28.98 24.31,38 30.18,43.87 30.18,64.51 29.38,65.3 29.38,66.78 30.11,67.51 R10.1 30.18,68.63 31.55,70 35.89,70 40.92,75.03 40.92,77.09 U6.7
1SDA  (via drill 0.33)
  Top 0.254: U4.3 41.81,17.6 42.15,17.6 42.34,17.79 42.34,53.8 R9.1 30.18,66.12 v31.09,67.03 | v37.72,78.23 39.78,78.23 40.23,77.78 40.23,77.32 U6.6
  Bottom 0.254: v37.72,78.23 37.72,73.66 v31.09,67.03
2
  Top 0.254: U$67.2-OUT2 88.92,57.2 88.92,95.15 94.87,101.09 U$51.T_IRQ
2SCL  (via drill 0.33)
  Top 0.254: U1.4 67.21,16.95 67.55,16.95 68.2,17.6 68.2,21.4 43.26,46.34 43.26,54.18 34.65,62.79 34.65,64.75 | R14.1 33.92,67.51 34.65,66.78 34.65,64.75 | v42.29,75.26 42.29,77.09 U6.9 | 34.65,64.75 v36.35,64.75
  Bottom 0.254: v42.29,75.26 42.29,69.55 42.06,69.32 42.06,66.8 40.01,64.75 v36.35,64.75
2SDA
  Top 0.254: U1.3 67.21,17.6 67.55,17.6 67.75,17.79 67.75,21.21 42.8,46.15 42.8,53.99 33.92,62.88 R13.1 33.83,66.12 33.15,66.8 33.15,69.32 33.38,69.55 36.12,69.55 41.6,75.03 41.6,77.09 U6.8
3.3V  (via drill 0.33)  (1 unrouted)
  Top 0.254: C6.1 53.58,75.3 53.63,75.35 | 53.63,75.35 54.16,75.88 U5.6 54.86,75.95 55.32,75.95 55.78,76.4 55.78,76.63 | U6.24 37.21,82.78 37.21,81.15 38.61,79.76 39.09,79.76 | 39.09,79.76 44.58,79.76 46.1,78.23 C7.1 | U4.8 39.44,18.93 C12.1 37.95,18.8 v35.66,18.8 | U1.8 64.34,19.43 63.62,19.43 C2.1 63.32,19.25 62.41,18.34 62.41,16.97 63.55,15.82 65.15,15.82 65.84,16.51 | U3.8 89.99,19.18 | 89.99,19.18 89.73,19.44 C3.1 | C10.1 13.91,19.06 | 13.91,19.06 U2.8 | 22.17,87.61 20.8,88.98 20.8,90.12 D3.C | 22.17,87.61 29.95,79.83 31.32,79.83 31.77,79.38 31.77,75.49 31.55,75.26 30.86,75.26 24.69,69.09 24.69,68.63 R8.2 | 22.17,87.61 14.17,79.6 12.8,79.6 4.34,71.14 2.74,71.14 U$20.1 | 55.78,76.63 55.32,77.09 54.86,77.09 U5.8 | 55.78,76.63 56.69,76.63 U5.2 | R22.2 58.29,64.52 56.01,64.52 R21.2 55.78,64.52 53.72,66.57 53.72,73.2 | 53.72,73.2 53.72,75.26 53.63,75.35 | D10.C 71.32,87.61 66.98,87.61 D8.C 66.75,87.61 v65.61,86.46 | R5.1 60.12,77.55 v60.12,79.6 49.61,90.12 46.63,90.12 D6.C 46.41,90.12 v46.41,87.61 | v57.61,73.2 53.72,73.2 | R7.2 24.69,66.12 26.06,67.49 26.75,67.49 27.66,68.4 28.12,68.4 R10.2 28.35,68.4 28.35,67.26 | 28.35,67.26 28.35,66.12 R9.2 28.12,65.89 28.12,62.69 23.09,57.66 23.09,56.29 24,55.37 R26.2 24,55.14 22.86,54 22.86,50.57 24,49.43 R28.2 24,47.6 22.86,46.46 v22.86,18.8 | 39.55,43.48 35.89,43.48 R2.1 | 39.55,43.48 39.55,45.31 R27.1 39.78,45.54 40.69,46.46 40.69,54.46 v35.66,59.49 | 39.55,43.48 R1.1 | 39.78,67.26 39.78,68.4 R18.2 | 39.78,67.26 39.78,66.12 R17.2 | 32.23,67.26 32.23,68.4 R14.2 | 32.23,67.26 32.23,66.12 R13.2 | R15.2 35.89,66.12 v35.89,67.26 35.89,68.4 R16.2
  Top 0.254: v32.46,67.26 32.23,67.26 | v38.41,67.26 39.78,67.26 | v39.09,79.6 39.09,79.76 | 39.09,79.83 39.09,79.76 | v28.8,67.26 28.35,67.26 | U2.6 14.4,17.42 15.09,17.42 v15.32,17.65 15.77,18.11 16.23,18.11 U2.2 | v14.4,19.48 13.95,19.03 13.91,19.06 | 65.84,17.42 65.15,17.42 U1.6 | 65.84,17.42 66.52,18.11 66.98,18.11 U1.2 | 65.84,16.51 65.84,17.42 | R4.1 104.01,42.8 101.73,42.8 R3.1 101.5,42.8 v98.53,42.8 | 91.44,17.42 90.53,17.42 U3.6 | 91.44,17.42 92.13,18.11 92.35,18.11 U3.2 | v91.44,17.65 91.44,17.42 | 89.99,19.18 v90.3,19.48 | v66.29,16.05 65.84,16.51 | 40.57,17.53 41.15,18.11 41.6,18.11 U4.2 | 40.57,17.53 40.46,17.42 39.78,17.42 U4.6 | v40.64,17.46 40.57,17.53
  Bottom 0.254: v65.61,86.46 65.61,82.35 62.87,79.6 60.81,79.6 | v60.12,79.6 60.81,79.6 | v57.61,73.2 60.12,73.2 60.81,73.89 60.81,79.6 | 35.66,67.26 v32.46,67.26 31.55,66.34 30.63,66.34 29.72,67.26 v28.8,67.26 27.89,66.34 26.98,66.34 22.4,70.92 2.74,70.92 U$20.1 | 35.66,67.26 v35.66,59.49 | 35.66,67.26 v35.89,67.26 v38.41,67.26 39.09,67.95 v39.09,79.6 46.41,86.92 v46.41,87.61 | v15.32,17.65 15.32,18.57 15.09,18.8 | v14.4,19.48 15.09,18.8 | 15.09,18.8 v22.86,18.8 v35.66,18.8 40.64,18.8 | v91.44,17.65 91.44,18.34 v90.3,19.48 | v90.3,19.48 90.3,32.51 97.84,40.06 97.84,42.11 | 97.84,42.11 97.84,42.34 96.7,43.48 92.81,43.48 | 92.81,43.48 91.44,42.11 U$67.3V3-1 | 97.84,42.11 v98.53,42.8 | v90.3,19.48 86.87,16.05 v66.29,16.05 65.61,15.37 63.32,15.37 59.89,18.8 40.64,18.8 | 92.81,43.48 92.81,63.37 96.24,66.8 96.24,73.43 95.1,74.57 95.1,75.49 U$51.RESET | 40.64,18.8 v40.64,17.46
3SCL
  Top 0.254: U3.4 92.47,16.59 90.9,15.03 85.24,15.03 58.61,41.66 58.61,48.33 42.28,64.65 37.65,64.65 37,65.3 37,66.78 37.73,67.51 R16.1 37.72,68.63 37.72,70.46 37.95,70.69 38.86,70.69 43.43,75.26 43.43,77.09 U6.11
3SDA
  Top 0.254: U3.3 92.61,17.6 92.95,17.6 93.14,17.79 93.14,21.21 76.07,38.29 63.05,38.29 61.15,40.19 61.15,48.77 57.86,52.06 57.86,52.95 45.7,65.11 | R15.1 38.27,66.04 39.2,65.11 45.7,65.11 | U6.10 42.98,77.32 42.98,77.55 41.6,78.92 34.06,78.92 32.69,80.29 30.18,80.29 29.95,80.52 29.95,83.95 31.55,85.55 47.32,85.55 48.92,83.95 48.92,76.63 48.23,75.95 48.23,67.72 45.72,65.2 45.7,65.11
4SCL  (via drill 0.33)
  Top 0.254: v56.01,75.49 56.24,75.26 56.69,75.26 U5.4 | v46.41,81.66 44.35,81.66 43.66,82.35 43.66,82.8 U6.14 | v43.43,68.63 41.6,68.63 R18.1
  Bottom 0.254: v56.01,75.49 52.58,75.49 51.44,76.63 | v46.41,81.66 51.44,76.63 | 51.44,76.63 v43.43,68.63
4SDA  (via drill 0.33)
  Top 0.254: v52.81,82.35 57.61,77.55 57.61,76.17 57.38,75.95 56.92,75.95 U5.3 | v45.03,82.35 44.35,83.03 U6.13 | v41.38,67.26 41.38,66.12 R17.1
  Bottom 0.254: v52.81,82.35 v45.03,82.35 44.58,82.35 39.55,77.32 39.55,69.09 v41.38,67.26
5V  (via drill 0.33)
  Top 0.254: C5.1 86.36,52.59 86.36,49.99 3V_REGULATOR.4 88,47.94 88,47.42 90.56,44.86 95.1,44.86 | 95.1,44.86 A4.2 | C1.1 98.24,64.77 97.83,65.19 | 97.83,65.19 U$51.VCC 93.2,68.09 89.91,71.39 R53.1 | 95.1,44.86 95.1,40.97 94.87,40.74 93.04,40.74 92.81,40.97 92.81,42.11 91.44,43.48 88.24,43.48 82.07,49.66 80.01,49.66 3V_REGULATOR.2 79.78,49.66 78.41,48.28 78.41,46.69 78.64,46.46 78.64,44.4 78.18,43.94 v75.89,43.94 75.67,44.17 75.67,50.8 80.92,56.06 89.38,56.06 90.07,56.74 90.07,57.43 97.83,65.19 | 97.84,65.2 97.83,65.19
  Bottom 0.254: v75.89,43.94 74.98,43.03 66.98,43.03 65.15,44.86 48.01,44.86 39.55,53.31 35.43,53.31 30.4,58.34 30.4,59.03 23.55,65.89 2.74,65.89 U$59.1
8
  Bottom 0.254: U$67.8-TX2/IN1 73.84,57.2 73.84,60.4 86.87,73.43 90.98,73.43 94.64,77.09 95.33,77.09 97.61,79.38 97.61,94.92 95.33,97.21 94.41,97.21 93.73,96.52 93.73,94.69 94.87,93.55 U$51.T_CS
9
  Bottom 0.254: U$67.9-OUT1C 71.32,57.2 71.32,58.57 90.98,78.23 94.87,78.23 U$51.D/C
10
  Bottom 0.254: U$67.10-CS/MQSR 68.58,56.97 69.72,56.97 70.64,56.06 74.3,56.06 74.98,56.74 74.98,58.57 89.38,72.97 94.87,72.97 U$51.CS
11
  Top 0.254: U$67.11-MOSI/CTX1 66.06,56.97 66.75,56.97 69.27,54.46 69.27,42.8 69.95,42.11 69.95,41.43 71.55,39.83 98.75,39.83 100.81,41.89 104.7,41.89 106.53,43.71 106.53,69.32 95.1,80.75 U$51.MOSI
  Bottom 0.254: U$51.T_DIN 95.1,95.83 95.1,94.92 97.16,92.86 97.16,83.03 95.1,80.97 U$51.MOSI
12  (via drill 0.33)
  Top 0.254: v69.04,64.06 63.55,58.57 63.55,57.2 U$67.12-MIO/MQSL | U$51.T_DO 95.1,98.35 95.1,97.43 96.24,96.29 96.24,89.66 95.1,88.52 U$51.MISO
  Bottom 0.254: v69.04,64.06 69.49,64.06 93.73,88.29 94.87,88.29 U$51.MISO
12V  (via drill 0.33)
  Top 0.254: 3V_REGULATOR.3 79.96,46.23 | 79.96,46.23 79.96,45.4 C4.1 79.78,45.09 82.75,45.09 R12.2 | C9.1 63.32,98.12 v63.32,96.98 60.35,94 58.52,94 54.86,97.66 54.86,99.03 55.78,99.95 R47.2 55.78,100.18 53.49,102.46 53.49,103.61 54.18,104.29 59.21,104.29 59.44,104.52 59.44,115.95 | v64.92,95.38 65.84,94.46 R41.2 | v79.32,46.23 79.96,46.23 | v74.3,47.6 74.3,54.92 72.24,56.97 72.24,75.49 v64.92,82.8 | 80.01,46.23 79.96,46.23 | 85.72,104.75 86.18,104.29 86.18,103.38 85.27,102.46 85.27,102.01 R50.2 | 85.72,104.75 71.55,104.75 U8.8 | 91.21,124.87 94.87,124.87 96.47,123.27 J6.1 | 91.21,124.87 88.92,124.87 87.33,123.27 74.98,123.27 J4.1 74.75,123.27 73.61,123.27 72.01,124.87 67.21,124.87 64.01,121.67 64.01,116.41 63.55,115.95 59.44,115.95 | 85.72,104.75 85.72,115.49 91.21,120.98 91.21,124.87 | v27.66,97.89 27.66,95.38 C8.1 | 28.35,102.69 29.26,103.61 U7.8 29.49,103.38 32.46,103.38 34.29,101.55 36.35,101.55 37.03,100.86 39.32,100.86 R44.2 | 28.35,102.69 v27.66,102.01 | 28.35,102.69 26.52,104.52 26.52,116.86 20.34,123.04 J1.1 | J2.1 40.69,123.04 49.38,123.04 54.41,118.01 54.41,115.95 J5.PWR 54.63,115.95 59.44,115.95 | v14.63,75.49 2.74,63.6 U$40.1
  Bottom 0.254: v63.32,96.98 v64.92,95.38 v64.92,82.8 | v79.32,46.23 75.67,46.23 v74.3,47.6 | U$40.1 2.74,63.37 5.49,63.37 18.75,50.11 SP2.1 | v27.66,102.01 v27.66,97.89 27.66,93.09 14.63,80.06 v14.63,75.49 | J1.1 20.34,123.27 24.69,123.27 26.29,124.87 38.86,124.87 40.46,123.27 J2.1
13
  Top 0.254: U$67.13-SCK/CRX1/LED 63.55,41.89 64.47,41.89 67.44,38.91 93.73,38.91 94.41,38.23 102.87,38.23 106.98,42.34 106.98,71.37 95.1,83.26 U$51.SCK
  Bottom 0.254: U$51.T_CLK 95.1,90.81 96.7,89.2 96.7,85.09 95.1,83.49 U$51.SCK
A0
  Top 0.254: U$67.14-A0/TX3/S-PFI_OUT 61.61,46.34 61.61,62.68 58.42,65.87 58.42,80.01 52.07,86.36 25.81,86.36 A0.2 24.69,87.83 24.92,88.06 24.92,90.12 D3.A | R40.1 17.83,95.61 21.49,95.61 R33.2 21.72,95.61 21.72,93.55 24.92,90.35 D3.A | D3.A 25.15,90.12 26.98,90.12 D5.C
A0_PC
  Top 0.254: U6.1 37.03,77.32 34.06,77.32 32.69,78.69 R19.1
A1
  Top 0.254: U$67.15-A1/RX3/S-PDIF_IN 67.25,43.24 66.86,43.24 62.23,47.88 62.23,63.5 58.88,66.85 58.88,80.2 52.26,86.82 40.23,86.82 | 40.23,86.82 39.32,86.82 A1.2 | R34.1 31.77,95.61 34.98,95.61 R35.2 35.2,95.61 40.46,90.35 D7.C | D7.C 40.46,90.12 42.29,90.12 D6.A | 40.23,86.82 40.23,90.12 D7.C
A1_PC
  Top 0.254: U6.2 37.72,76.4 37.49,76.17 32.69,76.17 R20.1
A2
  Top 0.254: U$67.16-A2/RX4/SCL1 69.85,43.18 69.85,64.77 63.09,71.53 A2.2 63.09,84.86 62.64,85.32 62.64,87.61 D8.A 62.41,87.61 60.58,87.61 D9.C 60.35,87.83 59.89,88.29 59.89,92.86 R36.1 59.66,93.09 56.01,93.09 R37.2
A2_PC
  Top 0.254: U6.21 39.09,83.03 39.09,83.49 38.63,83.95 35.2,83.95 32.69,81.43 R25.1
A3
  Top 0.254: U$67.17-A3/TX4/SDA1 75.12,43.37 75.12,57.6 75.34,57.81 A3.2 75.44,84.86 75.67,85.09 75.67,87.61 D10.A 75.89,87.61 77.5,87.61 | R38.1 73.84,91.95 77.27,91.95 R39.2 77.5,91.72 77.5,87.61 | 77.5,87.61 77.72,87.61 D11.C 77.5,87.61
FLOW1
  Top 0.254: 17.14,96.52 18.52,96.52 22.86,100.86 23.77,100.86 U7.3 | 17.14,96.52 16.69,96.06 16.69,95.15 20.57,91.26 21.49,91.26 23.55,89.2 23.55,87.83 A0.1 | 17.14,96.52 12.57,101.09 12.57,114.81 13.26,115.49 13.26,123.04 J1.3
FLOW2  (via drill 0.33)
  Top 0.254: 30.63,96.06 31.09,96.52 32.46,96.52 32.69,96.75 32.69,98.12 31.32,99.49 29.49,99.49 U7.5 | 30.63,96.06 30.63,95.15 34.52,91.26 36.8,91.26 37.49,90.58 37.49,87.83 A1.1 | v22.17,120.07 22.17,116.86 26.06,112.98 26.06,100.63 30.63,96.06
  Bottom 0.254: v22.17,120.07 25.15,123.04 33.6,123.04 J2.3
FLOW3
  Top 0.254: 66.75,101.55 66.52,101.78 66.29,101.78 65.84,102.23 U8.3 | 66.75,101.55 66.75,99.03 63.78,96.06 63.78,84.86 A2.1 | 66.75,101.55 66.75,105.21 64.69,107.26 64.69,114.81 67.89,118.01 67.89,123.04 J4.3
FLOW4
  Top 0.254: 70.41,100.86 69.27,100.86 64.24,95.83 64.24,94.46 69.95,88.75 72.24,88.75 74.52,86.46 A3.1 | 70.41,100.86 71.32,100.86 U8.5 | 70.41,100.86 70.41,105.21 70.64,105.44 74.98,105.44 89.38,119.84 89.38,123.04 J6.3
GND  (via drill 0.33)
  Top 0.254: 23.87,97.43 23.87,97.15 C8.2 25.83,95.15 30.63,90.35 31.32,90.35 D5.A 31.55,90.12 35.89,90.12 D7.A | 23.87,97.43 U7.4 24,99.72 25.38,101.09 25.38,104.52 22.86,107.04 21.72,107.04 R58.1 21.49,107.04 18.75,107.04 | U8.4 64.5,100.97 C9.2 63.32,100.18 v62.18,100.18 | U5.7 54.16,76.53 53.66,77.03 | 53.66,77.03 53.58,77.1 C6.2 51.89,77.32 v49.61,77.32 | U6.12 44.7,76.6 44.7,75.56 45.27,75 C7.2 48.26,77.16 48.26,77.32 | 3V_REGULATOR.1 81.28,53.42 81.28,54.36 81.53,54.61 C5.2 83.47,55.54 84.88,55.54 85.68,54.74 89.15,54.74 | C4.2 76.33,46.34 76.33,50.8 77.47,51.94 79.81,51.94 3V_REGULATOR.1 | C12.2 37.97,17.65 38.48,18.16 38.54,18.11 U4.7 40.33,18.11 40.97,18.75 | C2.2 63.5,17.65 64.01,18.16 64.96,18.16 U1.7 65.16,18.25 65.5,18.25 66.01,18.76 | U3.1 91.41,18.76 90.9,18.25 90.56,18.25 U3.7 90.27,18.25 89.93,18.25 89.89,18.29 89.41,18.29 89.41,18.28 C3.2 88.7,17.65 83.67,17.65 v72.69,28.63 | 66.01,18.76 U1.1 | U4.1 40.98,18.76 40.97,18.75 | C10.2 12.69,17.26 13.53,18.11 U2.7 14.8,18.11 15.45,18.76 U2.1 16.23,18.8 v16.23,23.14 | 101.68,59.77 101.6,59.69 99.06,59.69 U$67.GND1 94.11,54.74 89.15,54.74 | 101.68,59.77 104.12,62.21 C1.2 104.12,68.56 104.14,68.58 102.09,70.63 U$51.GND | U$67.GND3 91.49,44.4 88.17,44.4 80.48,52.09 3V_REGULATOR.1 | U$31.1 10.16,76.2 R20.2 30.86,76.4 v30.86,77.55 30.86,78.69 R19.2 | 48.26,77.32 48.26,83.82 46.99,85.09 31.75,85.09 30.85,84.19 v30.85,82.58 | v30.85,82.58 R25.2 | R48.1 58.29,105.21 v57.15,105.21 54.63,105.21 C14.2 54.41,104.98 50.06,104.98 | 55.55,94.46 54.86,93.78 54.86,89.2 56.24,87.83 D9.A | 55.55,94.46 55.78,94.69 R37.1
  Top 0.254: R57.1 35.66,107.04 41.83,107.04 R56.1 42.06,107.04 45.03,107.04 48.01,104.06 | R35.1 35.2,97.43 39.78,97.43 42.98,100.63 C13.2 43.2,100.86 46.86,100.86 R45.1 47.09,100.86 48.01,101.78 48.01,102.01 | 48.01,102.01 48.01,104.06 | 48.01,102.01 55.55,94.46 | 50.06,104.98 48.92,104.98 48.01,104.06 | 18.75,107.04 17.83,107.04 R59.1 | 23.87,97.43 21.72,97.43 R33.1 | 71.32,94.46 69.95,94.46 R42.1 | 71.32,94.46 73.61,96.75 C11.2 | 78.64,94.23 81.15,96.75 R51.1 81.38,96.98 82.3,97.89 82.3,99.95 | 78.64,94.23 78.18,93.78 77.5,93.78 R39.1 77.27,93.55 76.58,92.86 72.92,92.86 71.32,94.46 | 82.3,99.95 81.38,100.86 81.38,101.78 C15.2 | 78.64,94.23 82.07,90.81 82.07,87.83 D11.A | 53.66,77.03 54.41,77.78 55.32,77.78 55.78,77.32 56.69,77.32 U5.1 | v48.23,77.32 48.26,77.32 | 71.09,107.04 74.75,107.04 R54.1 | 71.09,107.04 69.95,107.04 R55.1 | R23.1 94.18,107.04 97.61,107.04 R11.1 97.84,107.04 101.27,107.04 102.87,105.44 U$66.1 | 89.15,54.74 89.15,51.26 D2.C | v66.06,21.77 66.06,18.8 66.01,18.76 | 40.97,18.75 40.92,18.8 40.92,34.8 34.29,41.43 34.29,44.17 S5.SW- 34.06,44.4 31.77,46.69 31.77,58.8 S5.C | 71.09,107.04 71.09,122.81 71.32,123.04 J4.2 | v30.86,82.58 v30.85,82.58 | 82.3,99.95 84.58,99.95 91.44,106.81 91.44,120.52 92.81,121.89 92.81,123.04 J6.2 | 18.75,107.04 18.75,121.21 16.92,123.04 J1.2 | U$64.1 102.87,58.57 101.68,59.77 | 50.06,104.98 50.06,118.69 J5.GNDBREAK
  Bottom 0.254: U$67.GND3 91.44,39.37 66.06,39.37 | 66.06,39.37 35.56,39.37 34.29,40.64 | 34.29,40.64 34.16,40.77 S5.SW- | 34.29,40.64 16.23,40.64 | 16.23,40.64 8.64,40.64 Q2.1 5.08,44.94 6.35,46.21 6.35,47.26 5.08,48.53 U$63.1 1.49,56.93 1.49,66.48 2.54,67.53 U$31.1 2.54,69.63 1.49,70.68 1.49,101.82 U$65.1 5.08,111.45 J1.2 20.63,119.38 33.33,119.38 | J2.2 33.33,119.38 | 33.33,119.38 49.84,119.38 | 49.84,119.38 52.15,119.38 J5.GND 59.77,121.84 63.5,118.11 69.85,118.11 | 69.85,118.11 71.43,119.69 J4.2 | 69.85,118.11 90.17,118.11 93.02,120.96 J6.2 95.25,120.96 95.25,119.38 96.52,118.11 102.87,118.11 105.41,115.57 105.41,106.68 104.14,105.41 U$66.1 104.12,104.16 C1.2 | v57.15,105.21 v62.18,100.18 | v48.23,77.32 v49.61,77.32 | 66.06,39.37 66.06,28.63 | 66.06,28.63 v66.06,21.77 | 66.06,28.63 v72.69,28.63 | 16.23,40.64 v16.23,23.14 | 16.23,40.74 16.23,40.64 | v30.86,77.55 v30.86,82.58 | S3.3 50.06,48.06 45.49,48.06 35.89,57.66 32.92,57.66 31.77,58.8 S5.C | 49.84,119.38 49.84,118.92 J5.GNDBREAK
LED_1.1
  Bottom 0.254: U$67.0-RX1 94.18,57.2 94.18,64.06 98.07,67.95 98.07,107.04 91.44,113.66 91.44,115.04 88.92,117.55 56.46,117.55 55.55,118.47 53.26,118.47 50.52,115.72 15.54,115.72 14.17,114.35 D19.A
LED_1.2
  Bottom 0.254: U$67.1-TX1 91.44,56.97 90.3,56.97 81.61,48.28 58.06,48.28 55.78,50.57 50.06,50.57 48.69,51.94 48.69,62.92 51.89,66.12 51.89,67.03 49.61,69.32 47.09,69.32 46.86,69.55 46.86,70.46 50.29,73.89 60.12,73.89 60.35,74.12 60.35,75.95 23.32,112.98 21.49,112.98 20.34,114.12 D18.A
LED_2.1  (via drill 0.33)
  Top 0.254: v78.41,86.23 78.64,86 78.64,57.2 U$67.6-OUT1D | v63.32,116.86 55.32,124.87 39.32,124.87 38.86,124.41 38.86,120.07 33.15,114.35 D17.A
  Bottom 0.254: v78.41,86.23 78.41,90.81 79.78,92.18 79.78,111.38 74.3,116.86 v63.32,116.86
LED_2.2  (via drill 0.33)
  Top 0.254: v76.12,73.89 76.12,57.2 U$67.7-RX2/OUT1A | v64.01,82.58 v68.81,77.78
  Bottom 0.254: v76.12,73.89 72.69,73.89 v68.81,77.78 | v64.01,82.58 63.09,83.49 63.09,86.69 39.55,110.24 39.55,114.12 D16.A
LED_3.1
  Bottom 0.254: U$67.3-LRCLK2 86.18,57.2 85.5,57.2 84.35,58.34 78.18,58.34 77.5,57.66 77.5,56.74 76.35,55.6 74.3,55.6 72.24,53.54 70.64,53.54 67.21,56.97 67.21,112.98 66.06,114.12 D15.A
LED_3.2  (via drill 0.33)
  Top 0.254: v78.64,93.09 78.64,89.2 83.67,84.18 83.67,57.2 U$67.4-BCLK2
  Bottom 0.254: v78.64,93.09 78.64,107.95 72.47,114.12 D14.A
LED_4.1  (via drill 0.33)
  Top 0.254: v69.04,62.92 64.92,58.8 64.92,52.86 67.21,50.57 67.21,49.66 U$67.28-RX7
  Bottom 0.254: v69.04,62.92 93.27,87.15 95.33,87.15 96.24,88.06 96.24,88.75 95.33,89.66 94.64,89.66 90.3,94 90.3,114.12 D13.A
LED_4.2  (via drill 0.33)
  Top 0.254: v87.55,70 87.55,70.46 86.41,71.6 86.41,101.09 93.27,107.95 94.64,107.95 96.47,109.78 96.47,114.12 D12.A
  Bottom 0.254: v87.55,70 87.55,56.74 80.47,49.66 71.78,49.66 U$67.29-TX7
N$1  (via drill 0.33)
  Top 0.254: v64.01,16.51 64.24,16.74 64.92,16.74 U1.5 | v94.87,38.91 99.44,38.91 101.5,40.97 R3.2
  Bottom 0.254: v64.01,16.51 64.01,18.57 74.98,29.54 74.98,32.05 81.84,38.91 v94.87,38.91
N$2
  Top 0.254: R12.1 84.81,44.86 86.18,44.86 88.01,43.03 89.38,43.03 90.3,42.11 90.3,41.43 91.44,40.28 96.7,40.28 97.84,41.43 97.84,45.09 94.87,48.06 89.15,48.06 D2.A
N$3
  Top 0.254: R11.2 97.84,108.86 97.84,112.98 98.98,114.12 D12.K
N$5  (via drill 0.33)
  Top 0.254: v90.49,15.88 90.49,16.83 U3.5 | v102.23,39.05 104.14,40.96 R4.2
  Bottom 0.254: v90.49,15.88 102.23,15.88 v102.23,39.05
N$6  (via drill 0.33)
  Top 0.254: v39.69,15.88 39.69,16.83 U4.5 | v43.18,36.83 v43.18,18.1 | v41.59,38.42 41.59,41.28 39.69,41.28 R1.2
  Bottom 0.254: v39.69,15.88 43.18,15.88 v43.18,18.1 | v41.59,38.42 v43.18,36.83
N$7
  Top 0.254: R23.2 93.95,108.86 93.95,112.98 92.81,114.12 D13.K
N$8  (via drill 0.33)
  Top 0.254: v14.29,15.88 14.29,16.83 U2.5 | v28.57,23.5 v20.95,15.88 | v38.42,38.42 35.56,41.28 R2.2
  Bottom 0.254: v20.95,15.88 v14.29,15.88 | v28.57,23.5 38.42,33.34 v38.42,38.42
N$9
  Top 0.254: Q2.3 5.26,46.91 9.14,46.91 12.12,49.89 SP2.2
N$10
  Top 0.254: R24.1 3.66,41.43 3.66,44.86 3.2,45.31 Q2.2
N$11
  Top 0.254: R54.2 74.98,108.86 74.98,114.12 D14.K
N$12  (via drill 0.33)
  Top 0.254: v55.55,74.57 54.86,75.26 U5.5 | v59.66,74.57 59.66,75.03 60.12,75.49 R5.2
  Bottom 0.254: v59.66,74.57 v55.55,74.57
N$13
  Top 0.254: R55.2 69.72,108.86 69.72,112.98 68.58,114.12 D15.K
N$14
  Top 0.254: R56.2 41.83,108.86 41.83,114.12 D16.K
N$15
  Top 0.254: R57.2 35.66,108.86 35.66,114.12 D17.K
N$16
  Top 0.254: R58.2 21.72,108.86 21.72,112.98 22.86,114.12 D18.K
N$17
  Top 0.254: D19.K 17.6,113.21 17.6,108.86 R59.2
N$18
  Top 0.254: U8.7 71.55,103.61 73.61,103.61 R32.2 73.84,103.61 74.52,102.92 78.18,102.92 78.41,102.69 78.41,98.12 78.18,97.89 76.81,97.89 73.84,94.92 73.84,93.78 R38.2
N$19
  Top 0.254: U8.6 71.55,102.23 71.78,102.01 73.61,102.01 R32.1 73.84,102.01 77.27,102.01 R52.2
N$20
  Top 0.254: R36.2 59.89,94.92 59.89,96.75 60.81,97.66 60.81,98.58 60.35,99.03 58.98,99.03 58.75,99.26 58.75,101.55 62.18,104.98 R31.2 62.41,104.98 65.61,104.98 U8.1
N$21
  Top 0.254: R49.2 59.89,100.18 59.89,100.86 62.18,103.15 R31.1 62.41,103.38 65.61,103.38 U8.2
N$22
  Top 0.254: R30.2 31.55,102.46 31.32,102.23 U7.7 29.26,102.23 28.35,101.32 28.35,99.26 30.18,97.43 31.55,97.43 R34.2
N$23
  Top 0.254: U7.6 29.49,100.86 31.55,100.86 R30.1 31.77,100.86 35.43,100.86 R46.2
N$24
  Top 0.254: 21.26,102.69 21.26,101.32 17.83,97.89 17.83,97.43 R40.2 | 21.26,102.69 20.34,103.61 R29.2 | 21.26,102.69 21.95,103.38 23.77,103.38 U7.1
N$25  (via drill 0.33)
  Top 0.254: R29.1 20.12,102.01 20.12,102.46 19.2,103.38 19.2,104.29 19.43,104.52 v24.23,104.52 24.92,103.83 24.92,103.15 24,102.23 U7.2 | v76.35,96.06 76.58,96.06 77.27,96.75 R43.2 | v27.89,104.29 v46.63,104.29
  Bottom 0.254: v76.35,96.06 76.35,108.41 69.04,115.72 58.06,115.72 v46.63,104.29 | v27.89,104.29 24.46,104.29 v24.23,104.52
N$26
  Top 0.254: A4.1 U$67.VIN
N$35
  Top 0.254: R53.2 94.81,85.98 U$51.LED
PWM_BUZZER  (via drill 0.33)
  Top 0.254: v5.49,32.74 5.49,41.2 R24.2
  Bottom 0.254: v5.49,32.74 18.75,19.48 59.89,19.48 63.55,15.82 64.92,15.82 75.89,26.8 83.9,26.8 95.56,38.46 95.56,40.97 95.1,41.43 95.1,42.8 94.87,43.03 93.04,43.03 92.58,42.57 92.58,41.43 91.9,40.74 90.07,40.74 U$67.23-A9/CRX1/CCLK1
RESET
  Top 0.254: R6.2 35.66,73.66 38.41,76.4 38.41,77.09 U6.3
ROTARY_A
  Top 0.254: R27.2 39.55,47.37 37.72,49.2 37.49,49.2 34.29,52.4 34.29,58.8 S5.A
  Bottom 0.254: S5.A 41.15,58.8 54.18,45.77 76.58,45.77 80.24,42.11 81.15,42.11 U$67.20-A6/TX5/LRCLK1
ROTARY_B
  Top 0.254: R26.1 24.23,57.2 27.43,57.2 29.03,58.8 S5.B
  Bottom 0.254: U$67.21-A7/RX5/BCLK1 83.67,41.89 82.98,41.89 81.84,40.74 78.18,40.74 77.5,41.43 77.5,42.34 76.81,43.03 75.67,43.03 74.75,42.11 74.75,41.43 74.07,40.74 59.66,40.74 56.01,44.4 42.29,44.4 29.26,57.43 29.26,58.8 S5.B
ROTARY_SWITCH
  Top 0.254: R28.1 24,45.77 27.66,45.77 29.03,44.4 S5.SW+
  Bottom 0.254: U$67.22-A8/CTX1 86.18,41.89 85.5,41.89 83.44,39.83 40.23,39.83 34.52,45.54 30.4,45.54 29.26,44.4 S5.SW+
SCL  (via drill 0.33)
  Top 0.254: v38.63,81.66 38.41,81.89 38.41,82.8 U6.22 | v47.55,70 v38.41,70 | v57.38,63.6 58.29,62.69 R22.1 | v70.64,51.26 70.64,43.71 71.32,43.03 71.55,43.03 72.24,42.34 72.24,41.66 73.15,40.74 76.58,40.74 77.72,41.89 78.64,41.89 U$67.19-A5/SCL0
  Bottom 0.254: v38.63,81.66 38.63,80.29 38.41,80.06 v38.41,70 | v47.55,70 50.98,70 v57.38,63.6 57.38,61.54 65.38,53.54 67.44,53.54 69.72,51.26 v70.64,51.26
SDA  (via drill 0.33)
  Top 0.254: v43.89,80.52 38.63,80.52 37.72,81.43 37.72,82.8 U6.23 | v48.92,75.49 48.92,67.72 53.95,62.69 55.78,62.69 R21.1 | v55.55,43.71 55.55,45.09 42.06,58.57 v42.06,63.83
  Bottom 0.254: v43.89,80.52 v48.92,75.49 42.75,69.32 42.75,66.8 42.06,66.12 v42.06,63.83 | v55.55,43.71 58.98,40.28 74.52,40.28 76.12,41.89 U$67.18-A4/SDA0
SWITCH1
  Bottom 0.254: U$67.5-IN2 81.15,56.97 80.24,56.97 74.07,50.8 71.32,50.8 71.09,50.57 67.89,50.57 67.44,51.03 51.66,51.03 50.29,52.4 S3.1
X4
  Top 0.254: 58.29,98.35 59.66,98.35 R49.1 | 58.29,98.35 56.01,98.35 R47.1 | C14.1 54.63,103.38 58.29,103.38 R48.2 58.29,103.15 58.29,98.35
X5
  Top 0.254: 80.24,102.69 80.24,101.32 81.15,100.41 81.15,98.81 R51.2 | 80.24,102.69 81.15,103.61 C15.1 81.38,103.83 85.04,103.83 R50.1 | 80.24,102.69 79.32,103.61 77.5,103.61 R52.1
XX
  Top 0.254: R46.1 35.66,102.69 39.32,102.69 R44.1 39.55,102.69 42.98,102.69 C13.1 43.2,102.69 46.86,102.69 R45.2
XXX
  Top 0.254: R41.1 66.06,96.29 69.72,96.29 R42.2 69.95,96.29 71.32,96.29 73.61,98.58 C11.1 73.84,98.81 77.27,98.81 R43.1

### Text on the board
tPlace: 1 | GND | 12V | 2 | GND | 12V | 3 | GND | 12V | 4 | GND | 12V | 2 | 1 | 3 | 4 | PCA9548 | Project Flow Sensor / Manifold / 4/13/20 v0 | 3V | GND | 5V | 12V | I2C | 100uF | 4.7uF | 5V Reg | ROTARY / ENCODER | C | B | 1uF | 2K | E | BUZZ | 1 | 2 | 3 | 4